# EasyEDA schematic Arduino.json

## Sheets
1 Arduino_Keypad 3X3: TITLE: Sheet_1; REV: 1.0; Date: 2023-11-30; Sheet: 1/1; Company: Your Company
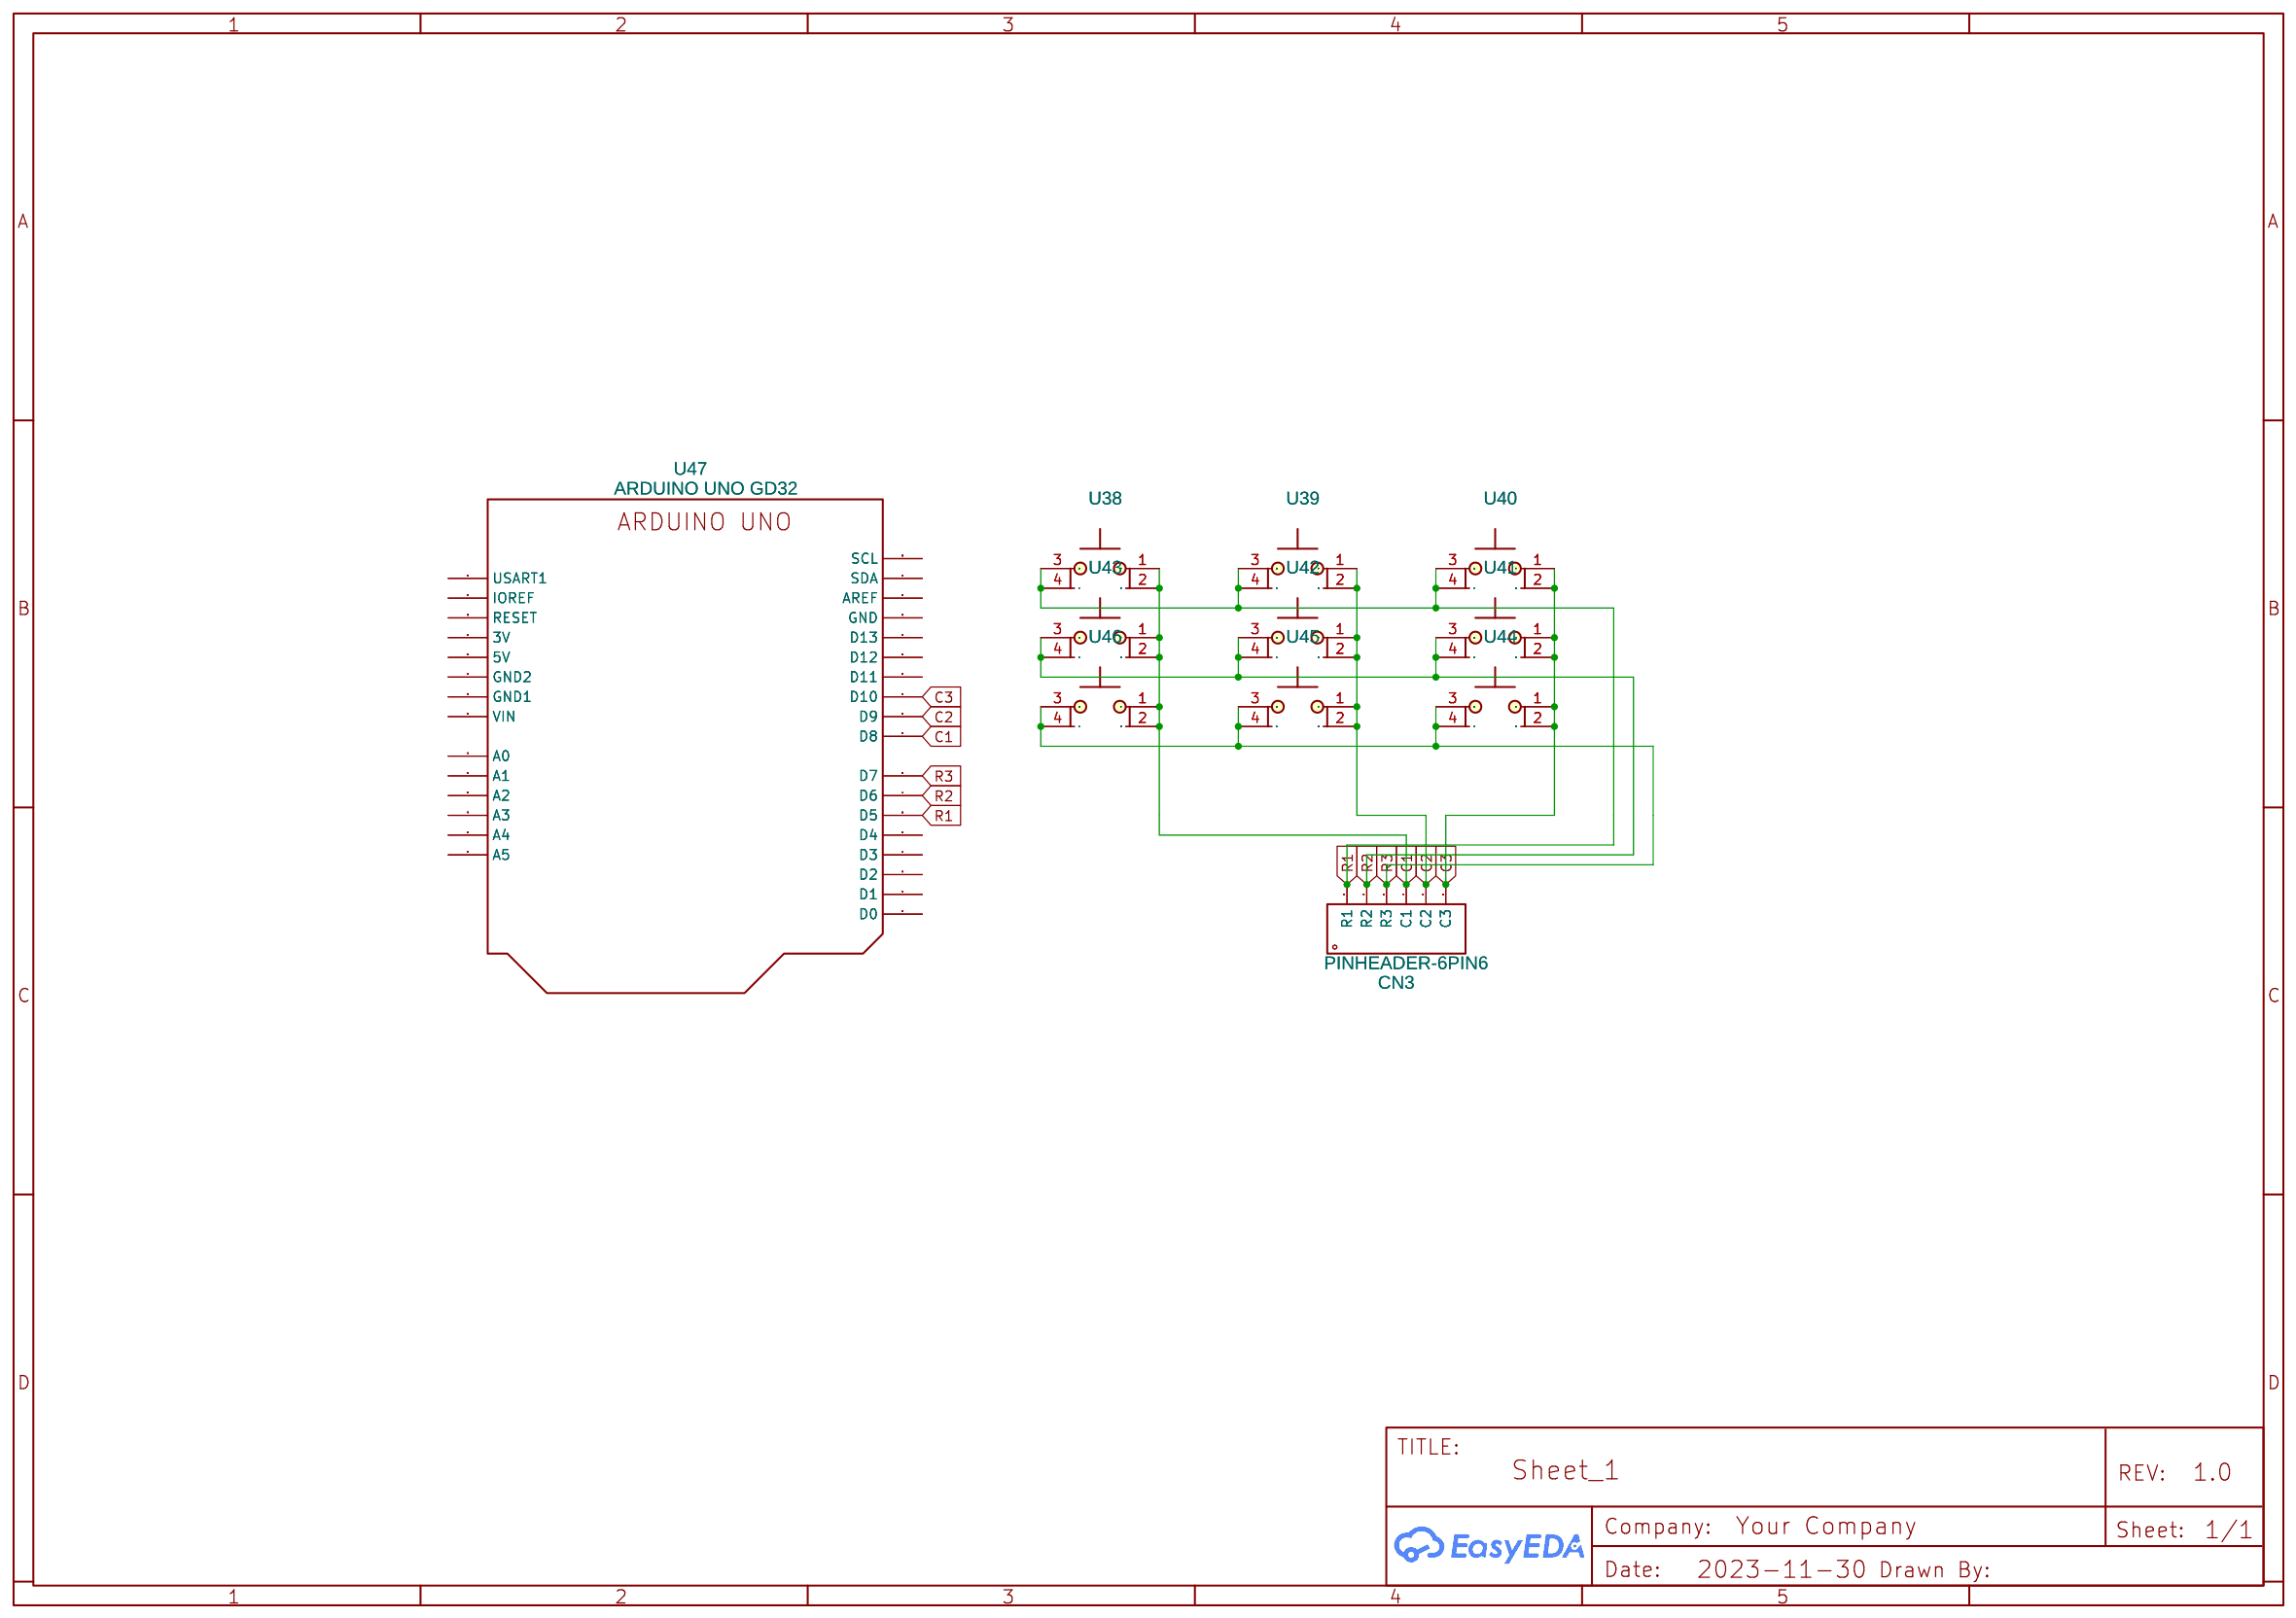
[diagram p0: Arduino_Keypad 3X3]
2 Arduino_LCD 16x2
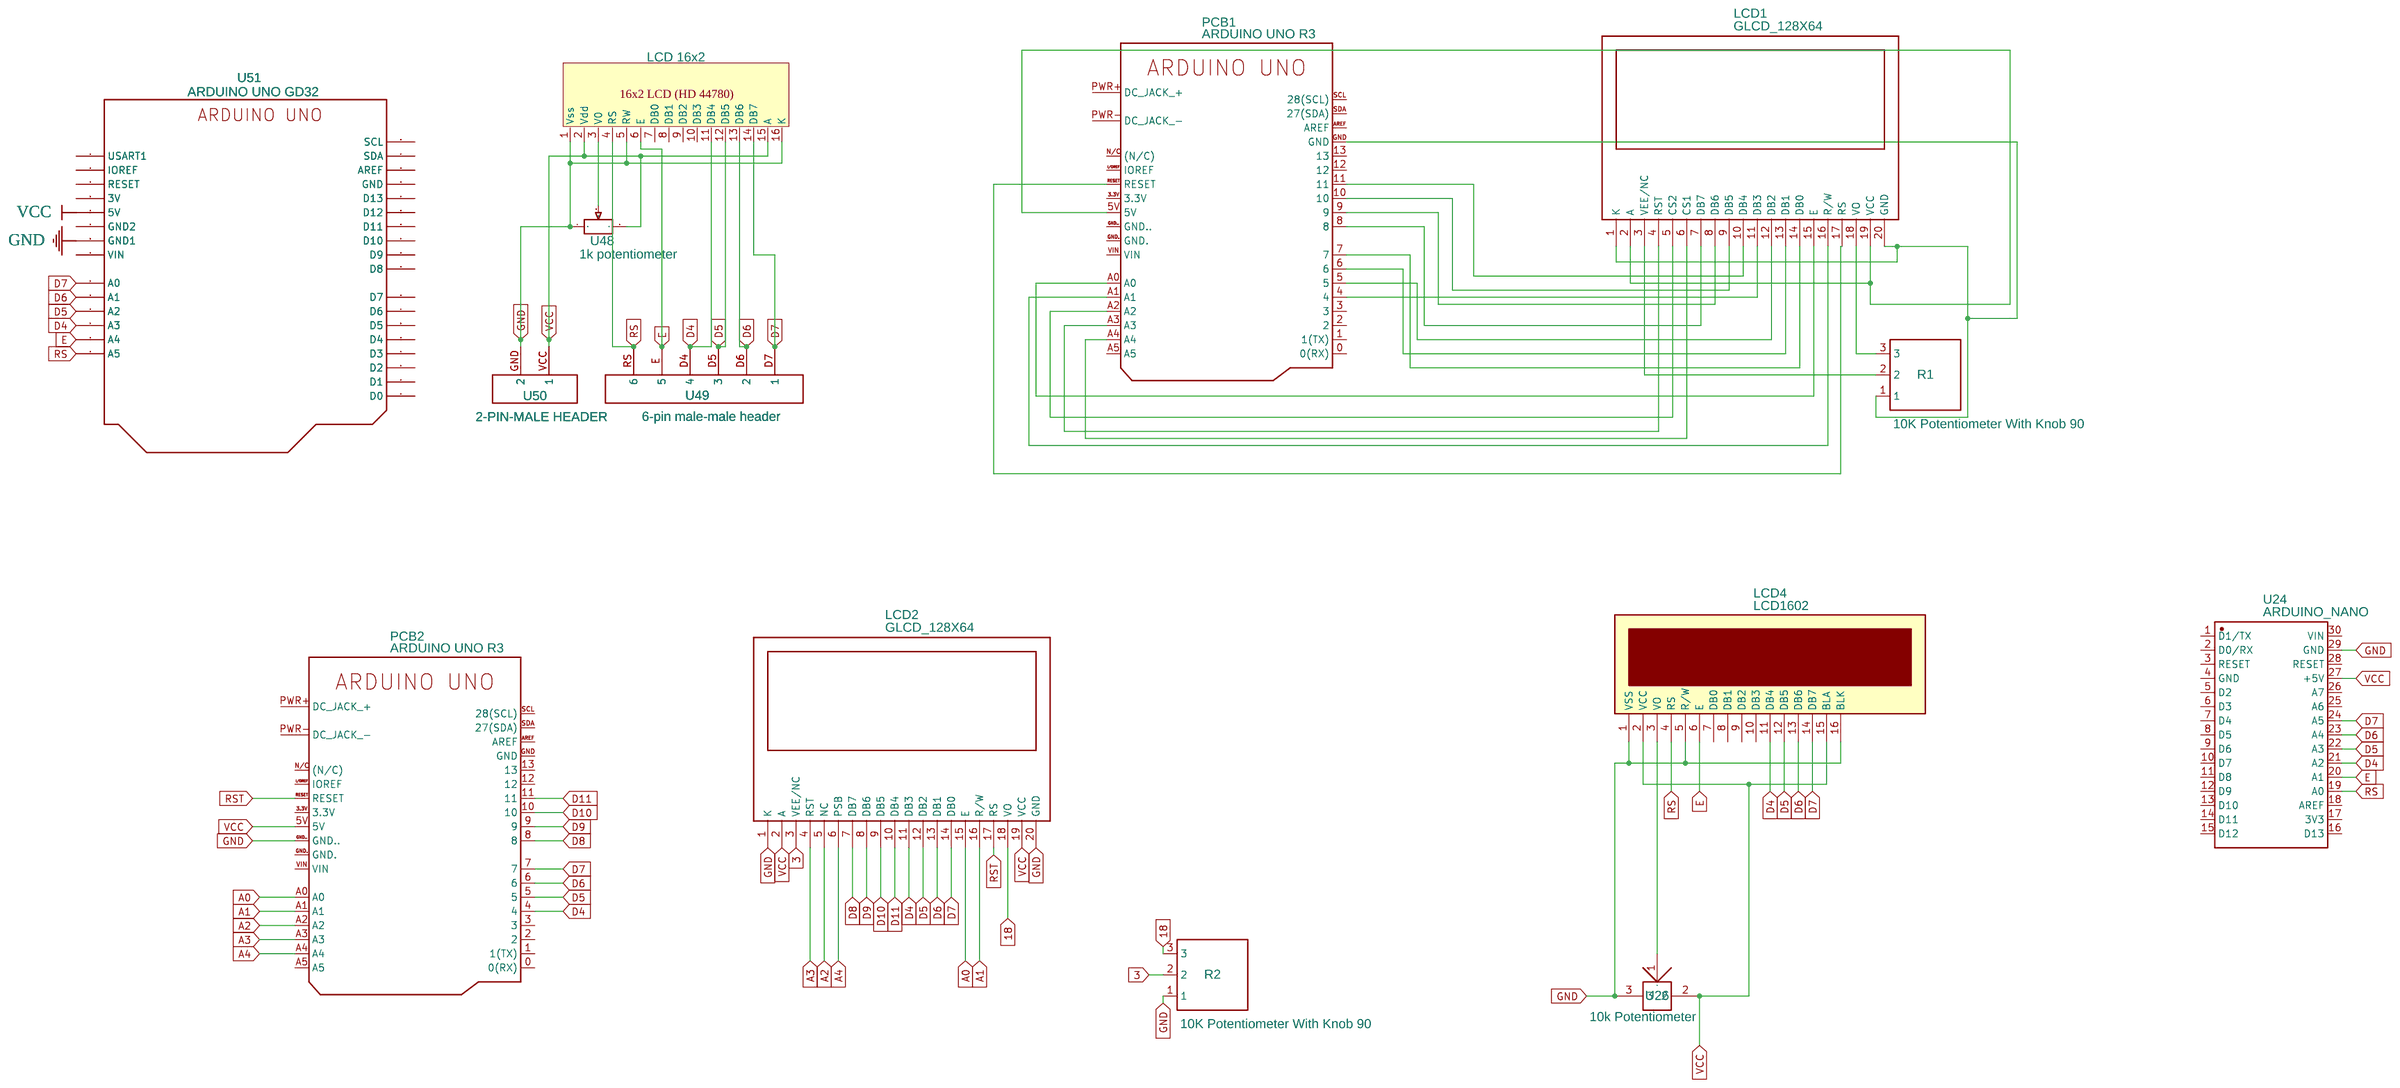
[diagram p1: Arduino_LCD 16x2]
3 Arduino_EM-18 Module
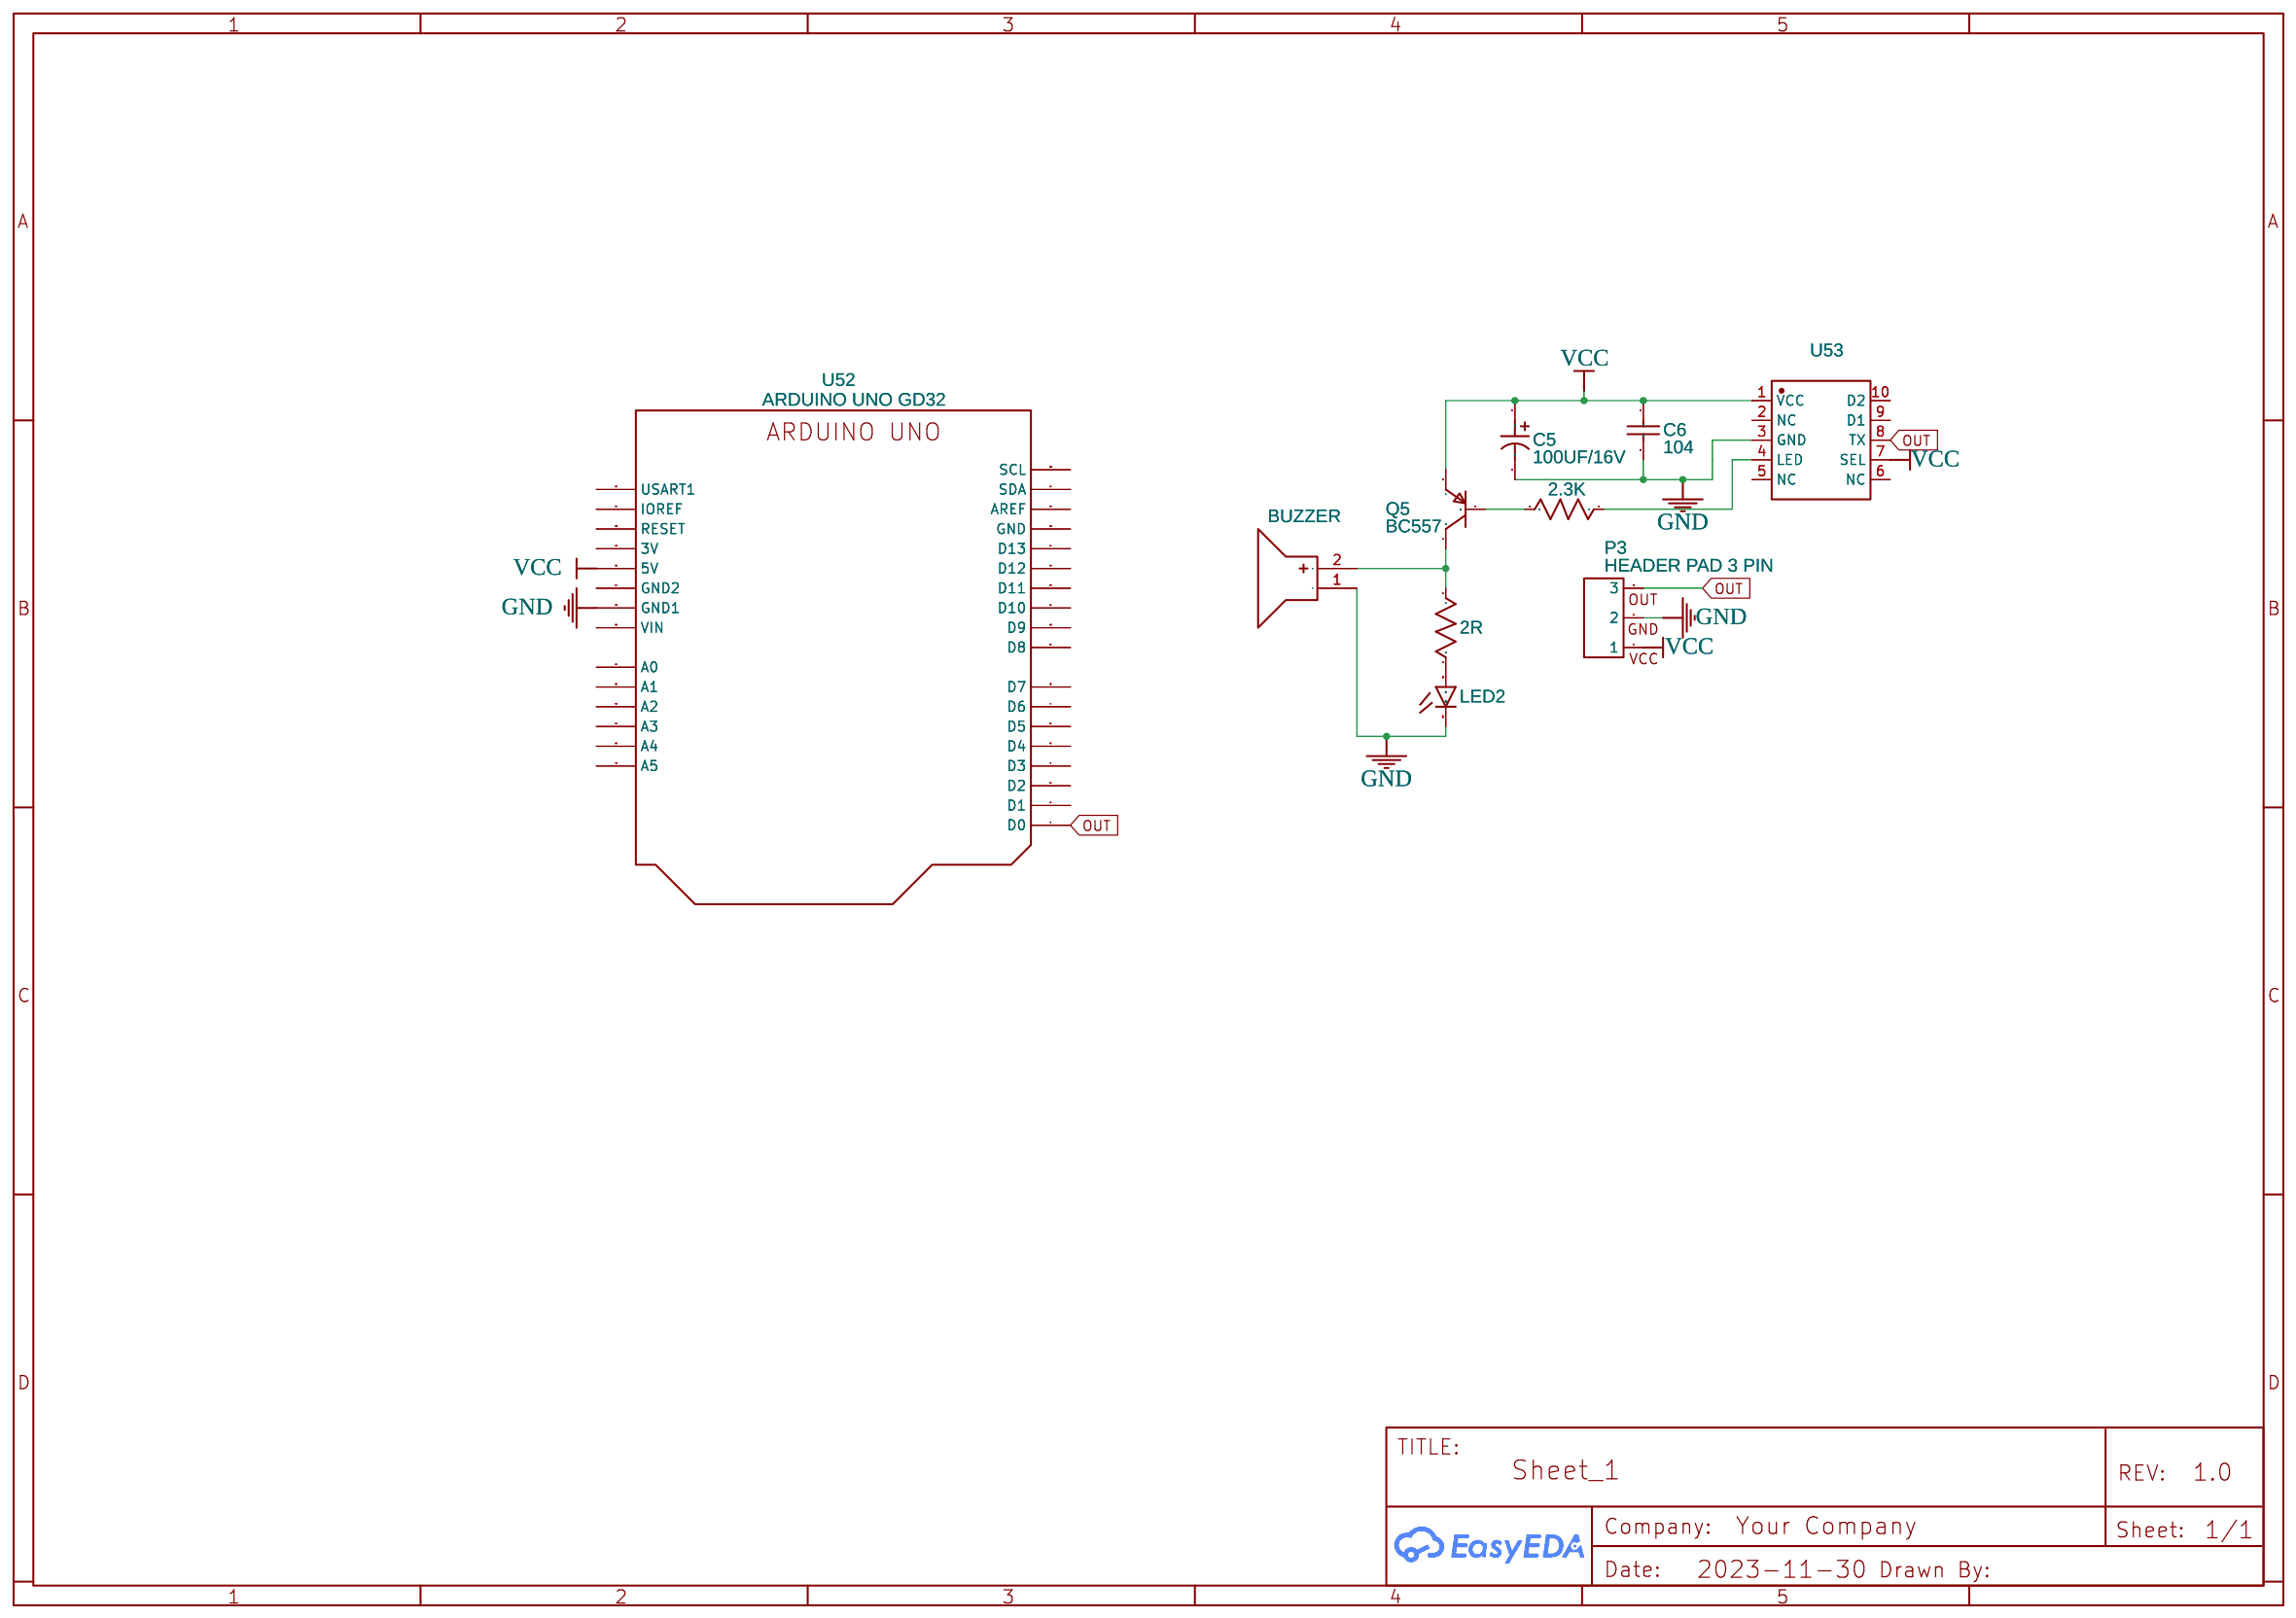
[diagram p2: Arduino_EM-18 Module]
4 Arduino_Relay Module
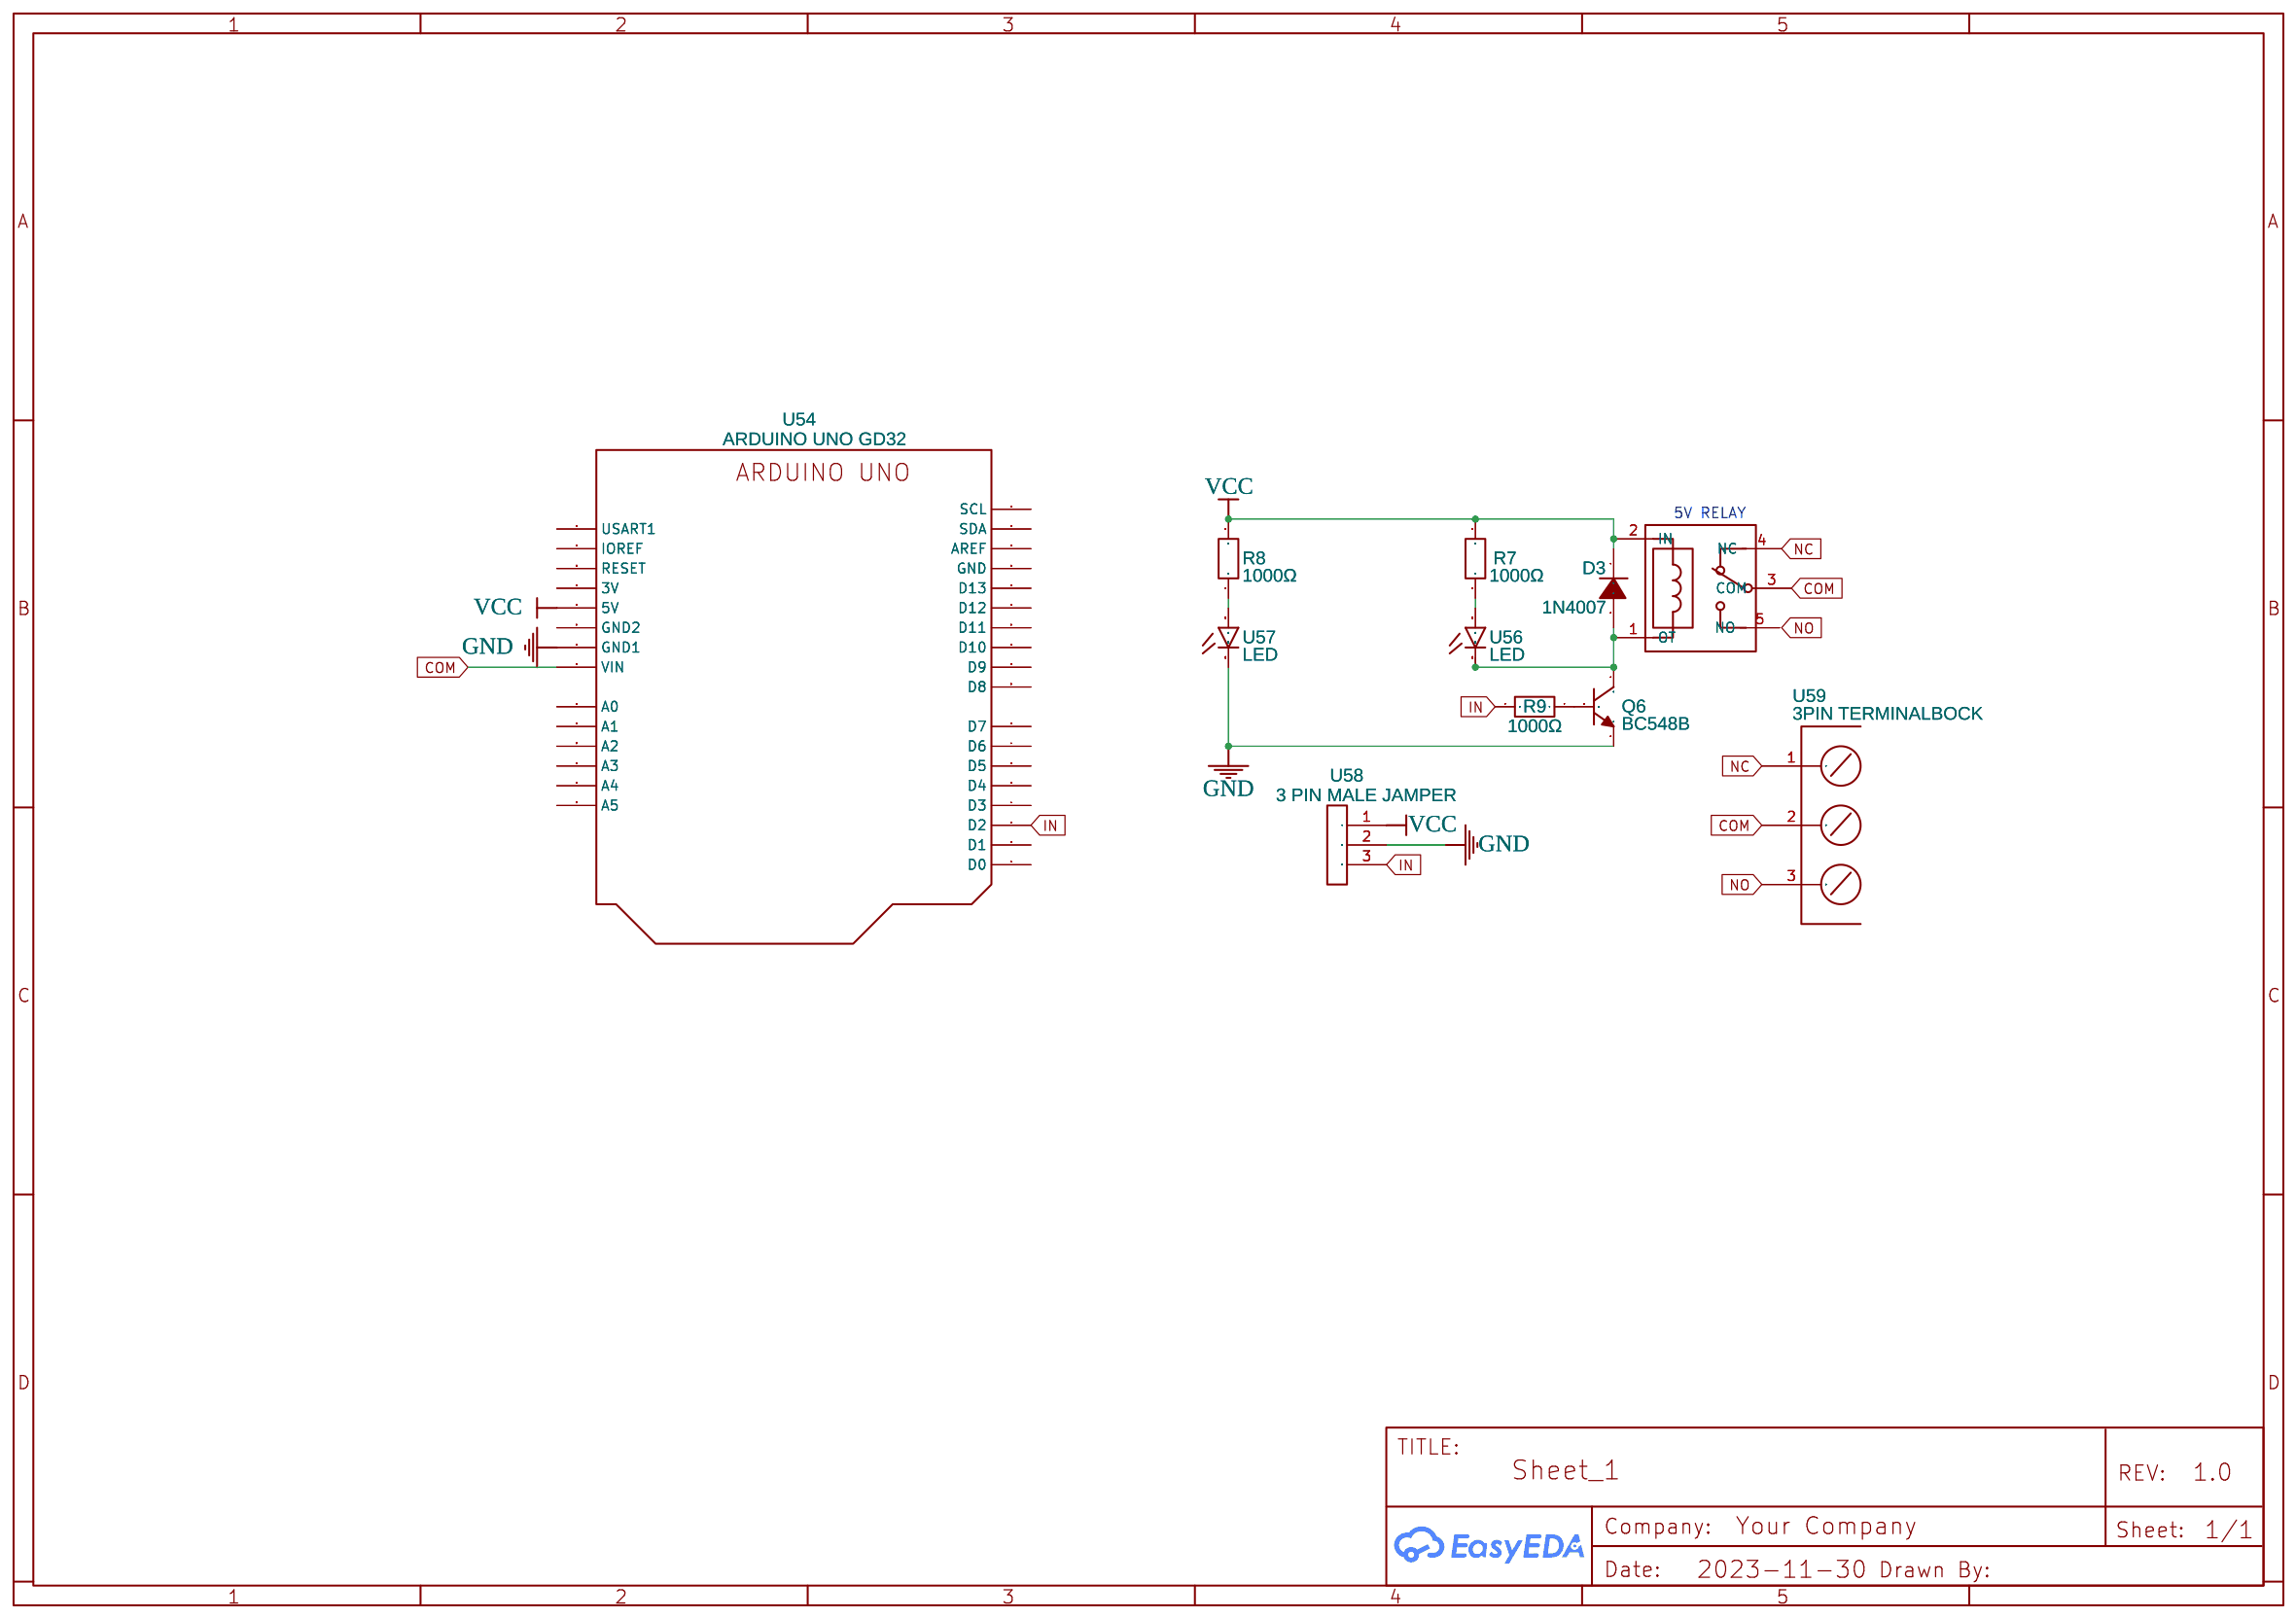
[diagram p3: Arduino_Relay Module]
5 DHT-11 & DHT-22: Date: 2024-01-26; Drawn By: robotic maker
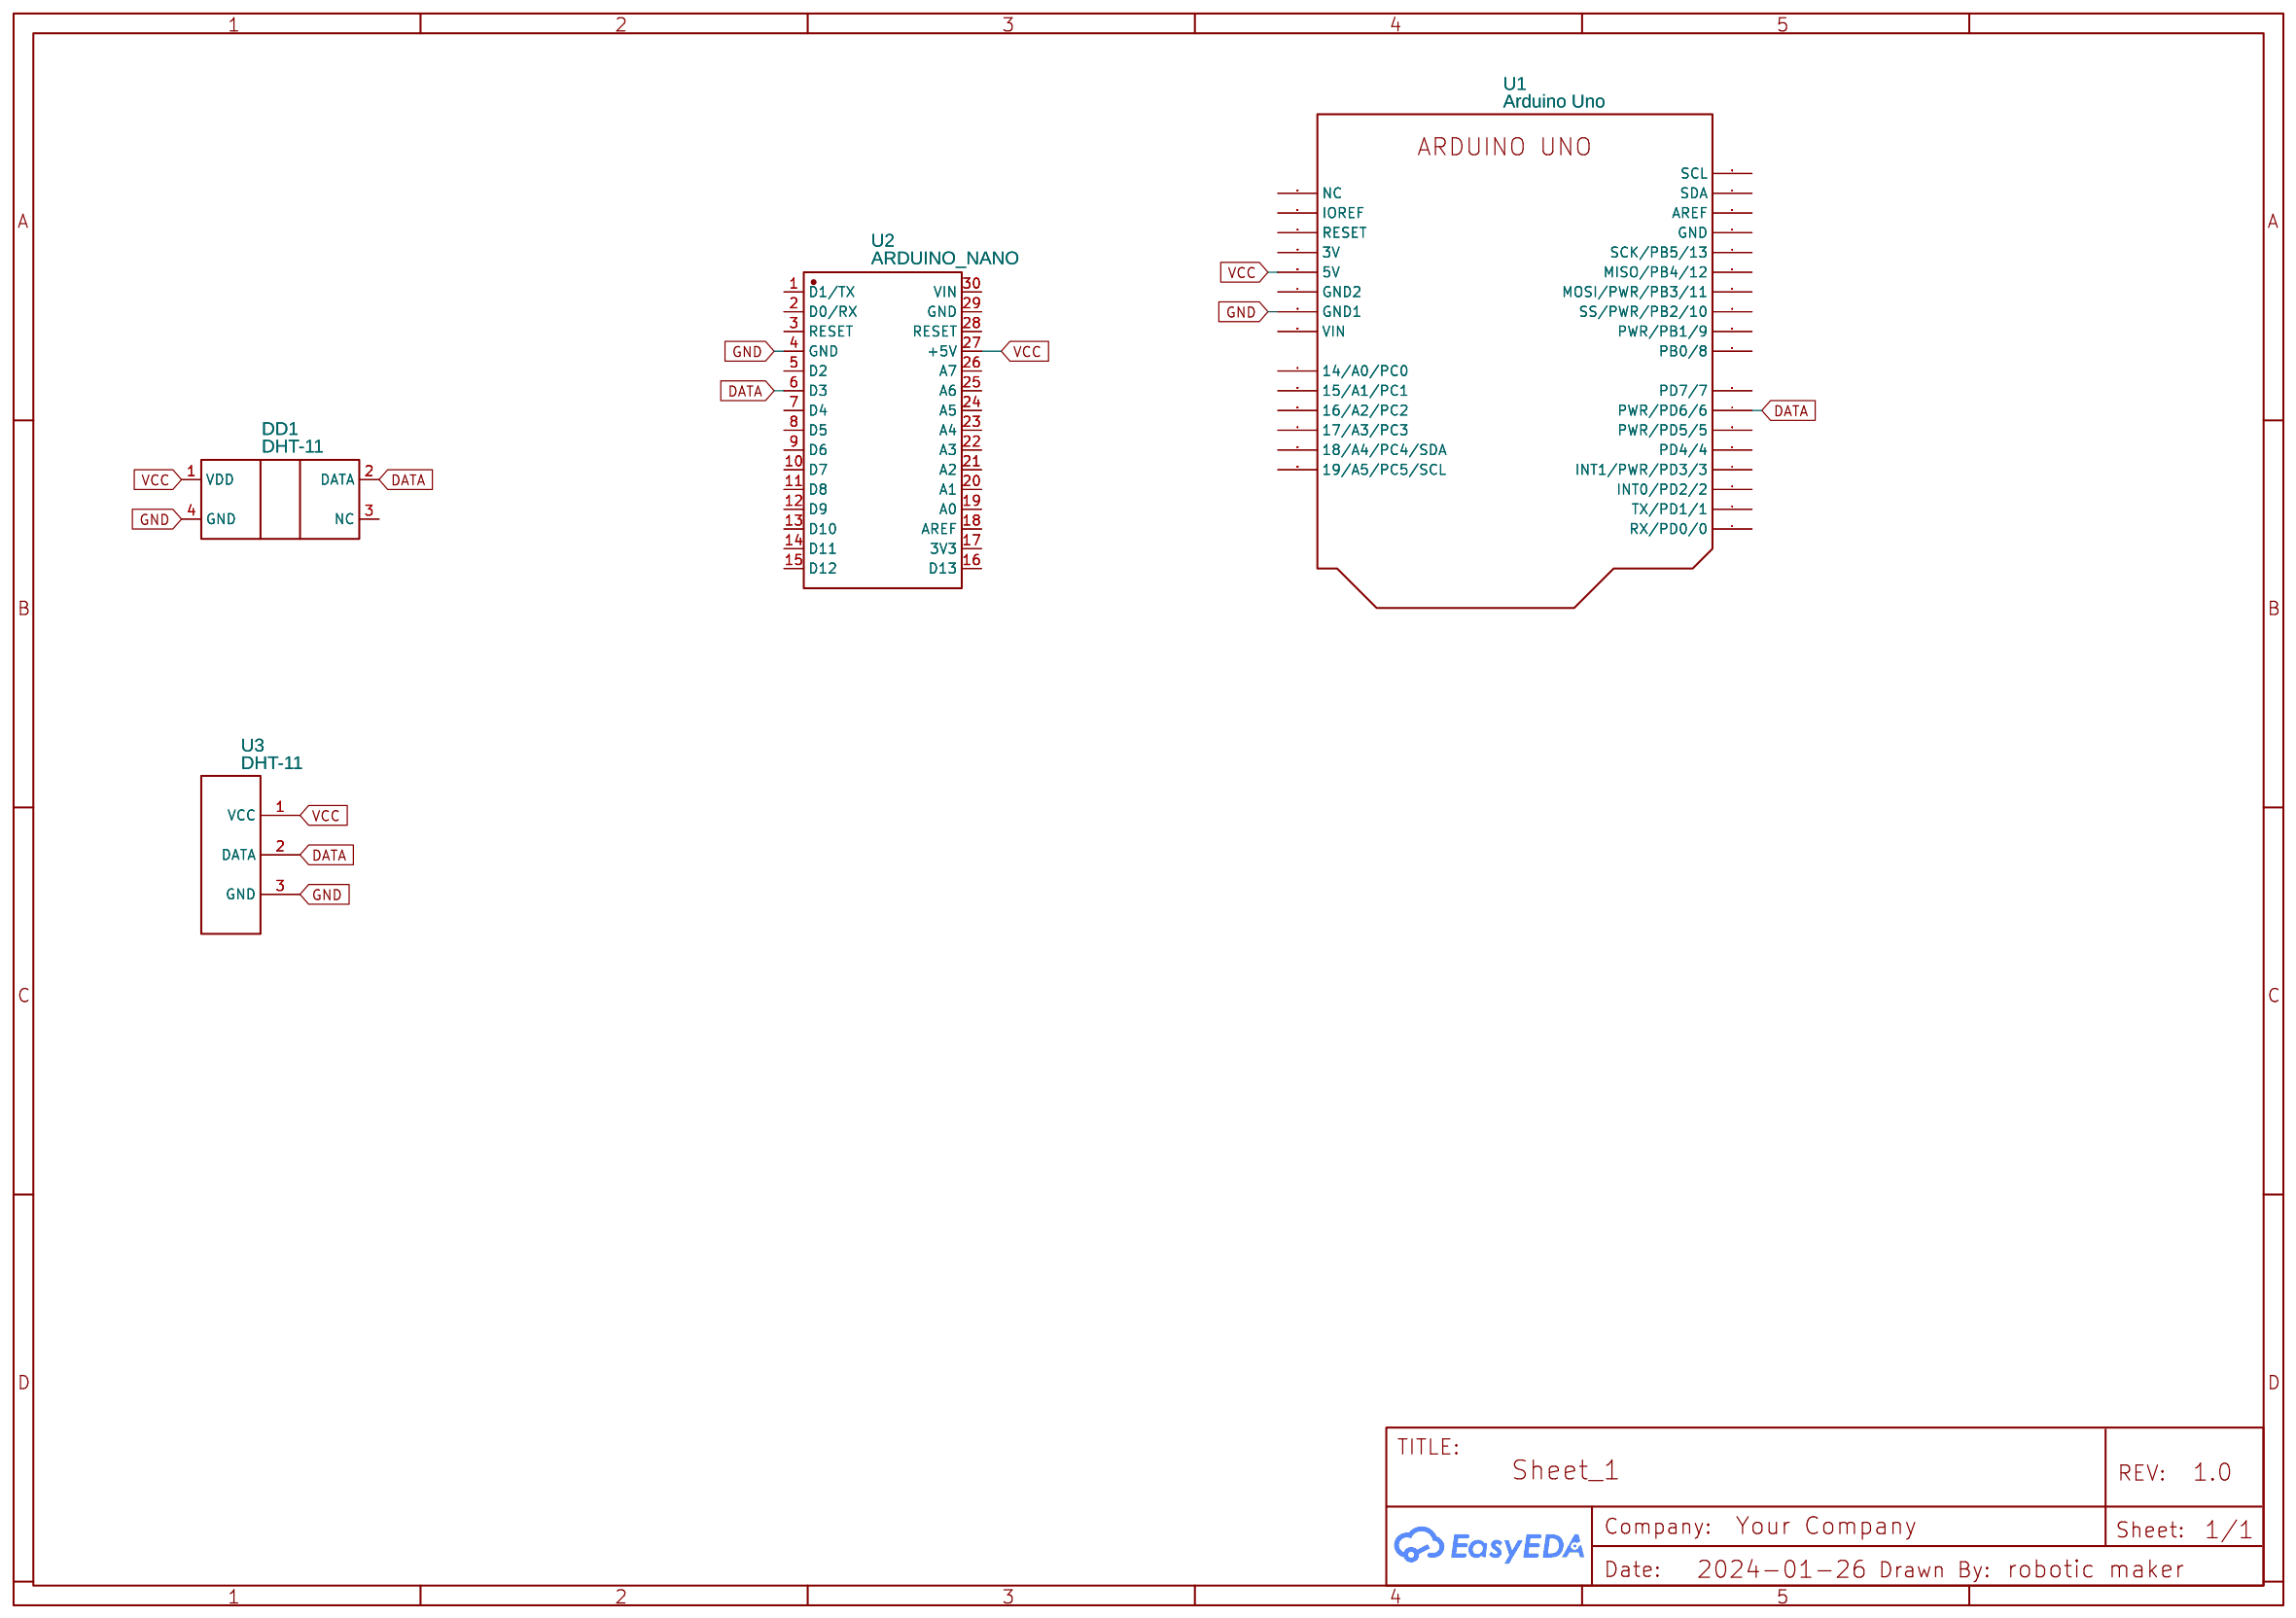
[diagram p4: DHT-11 & DHT-22]
6 Capacitive Soil Moisture Sensor: Date: 2024-01-26; Drawn By: robotic maker
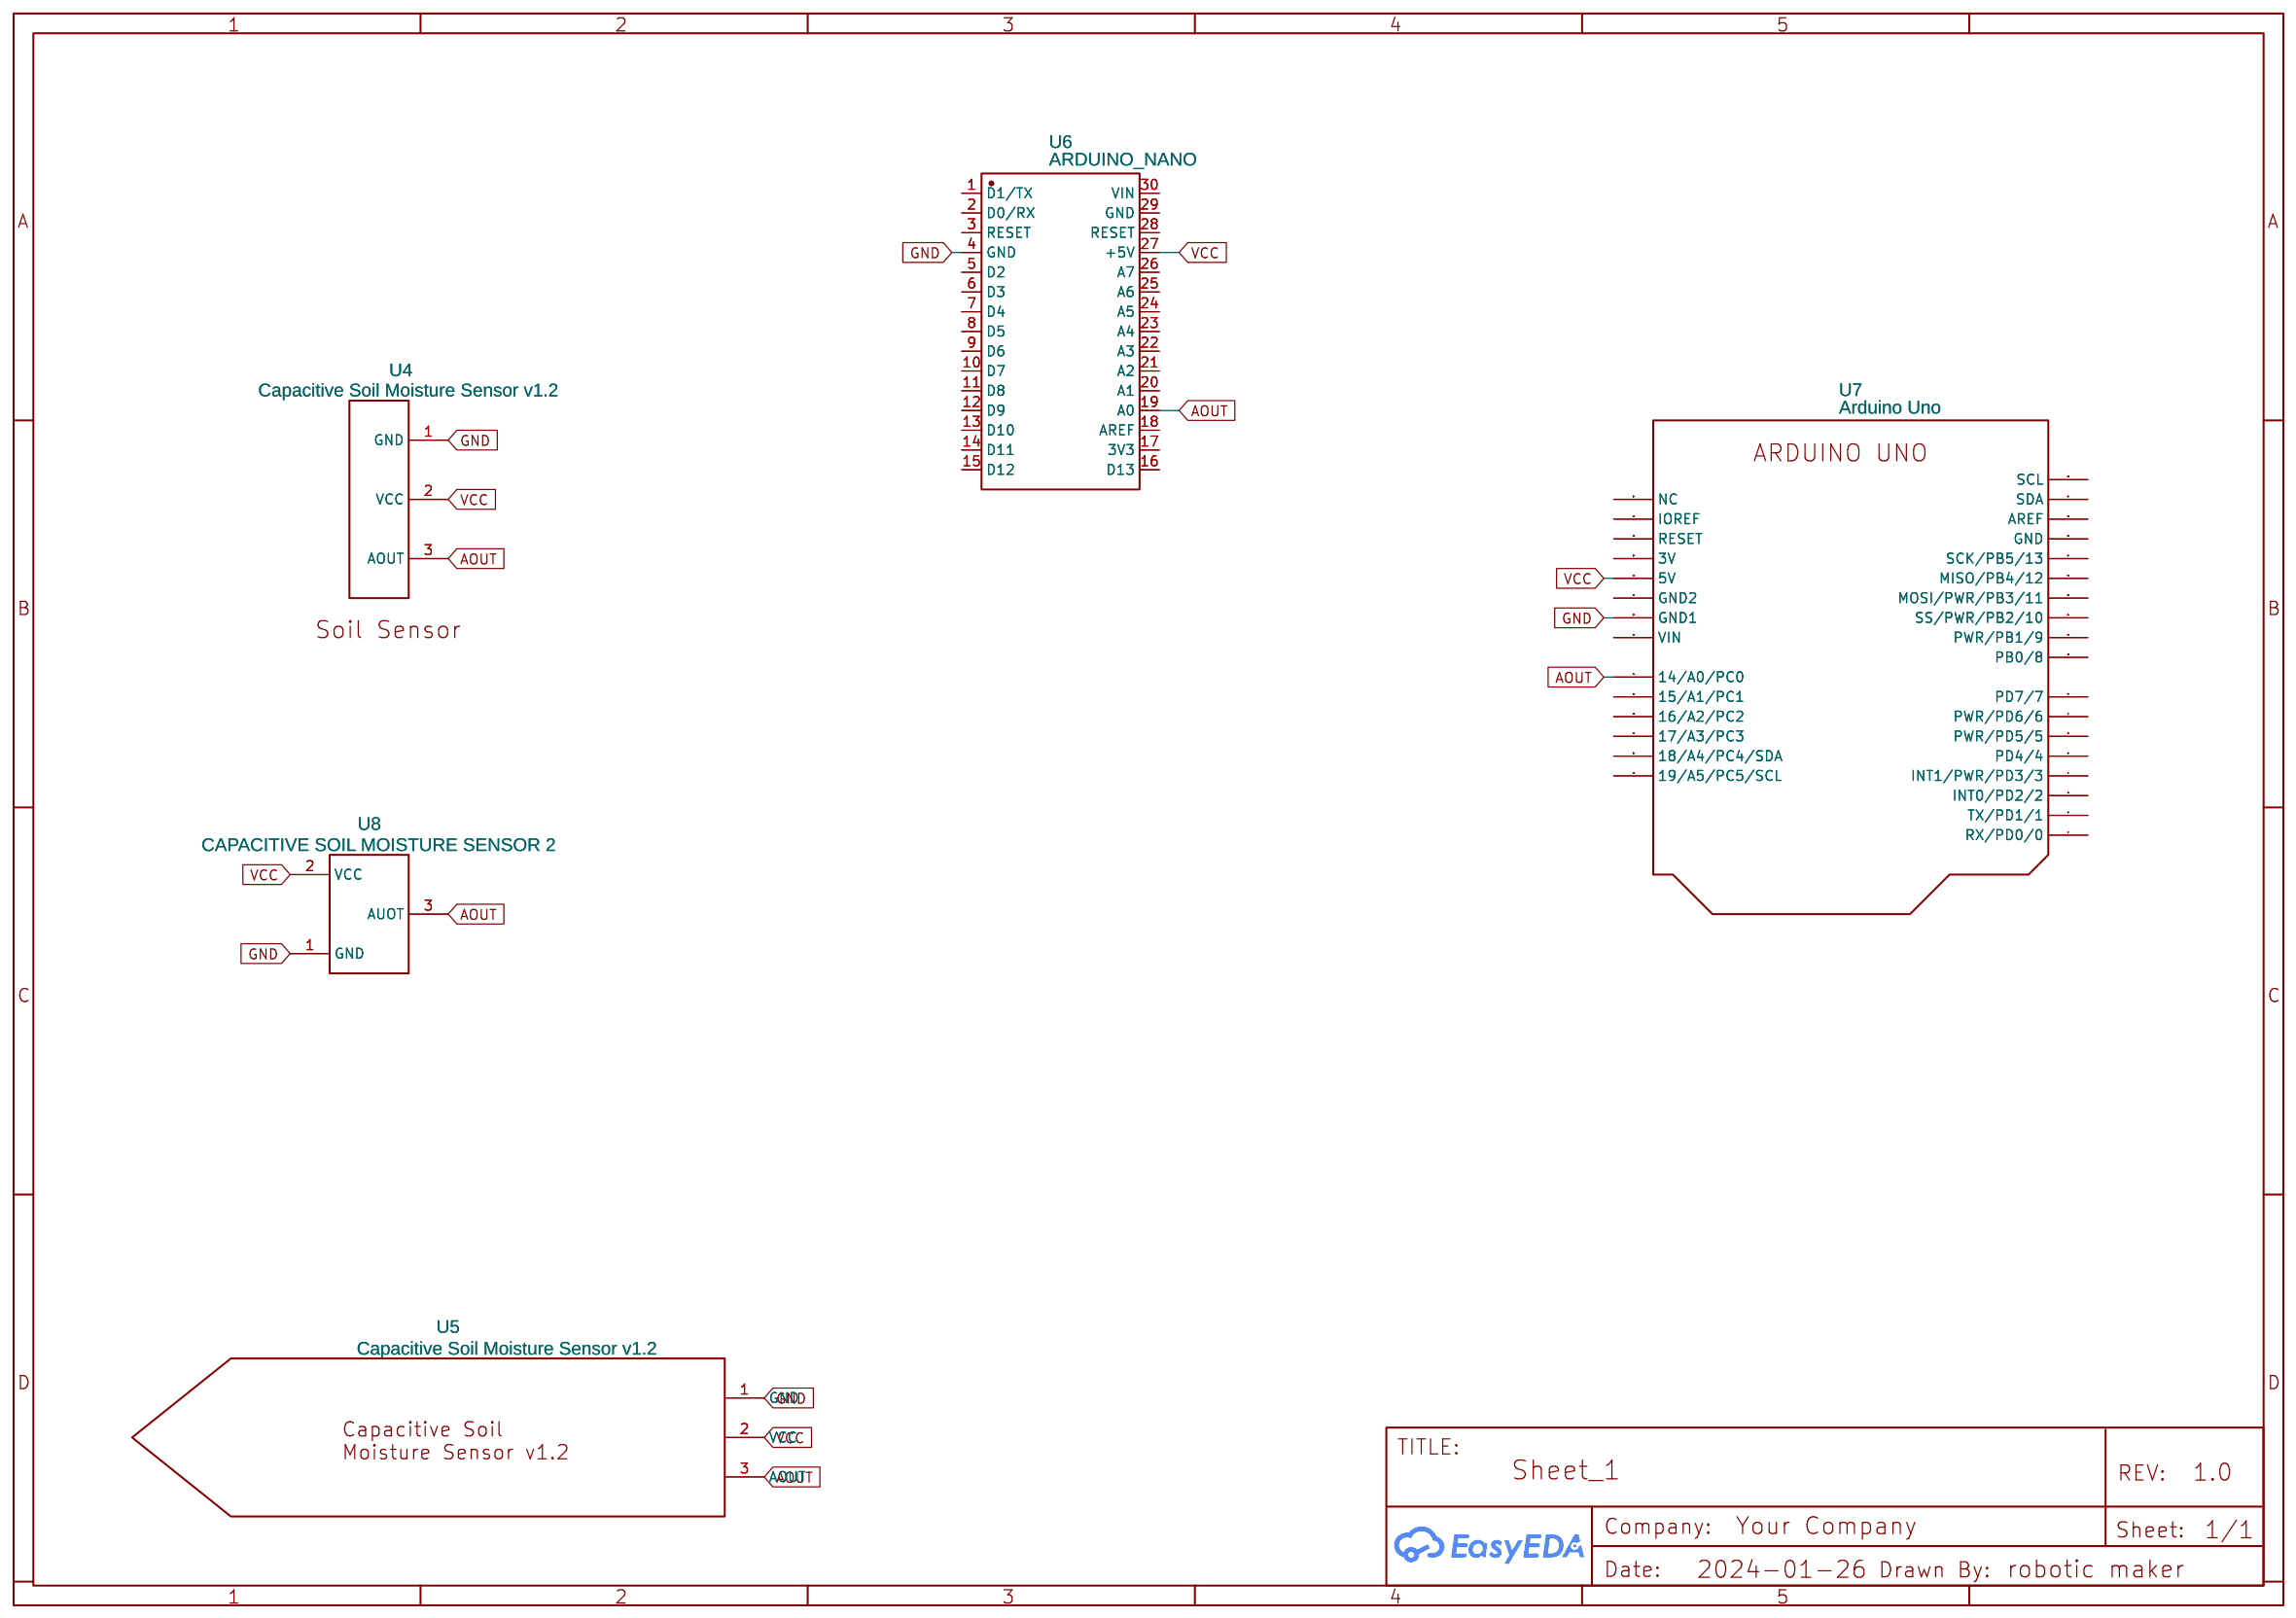
[diagram p5: Capacitive Soil Moisture Sensor]
7 Soil Moisture Sensor: Date: 2024-01-26; Drawn By: robotic maker
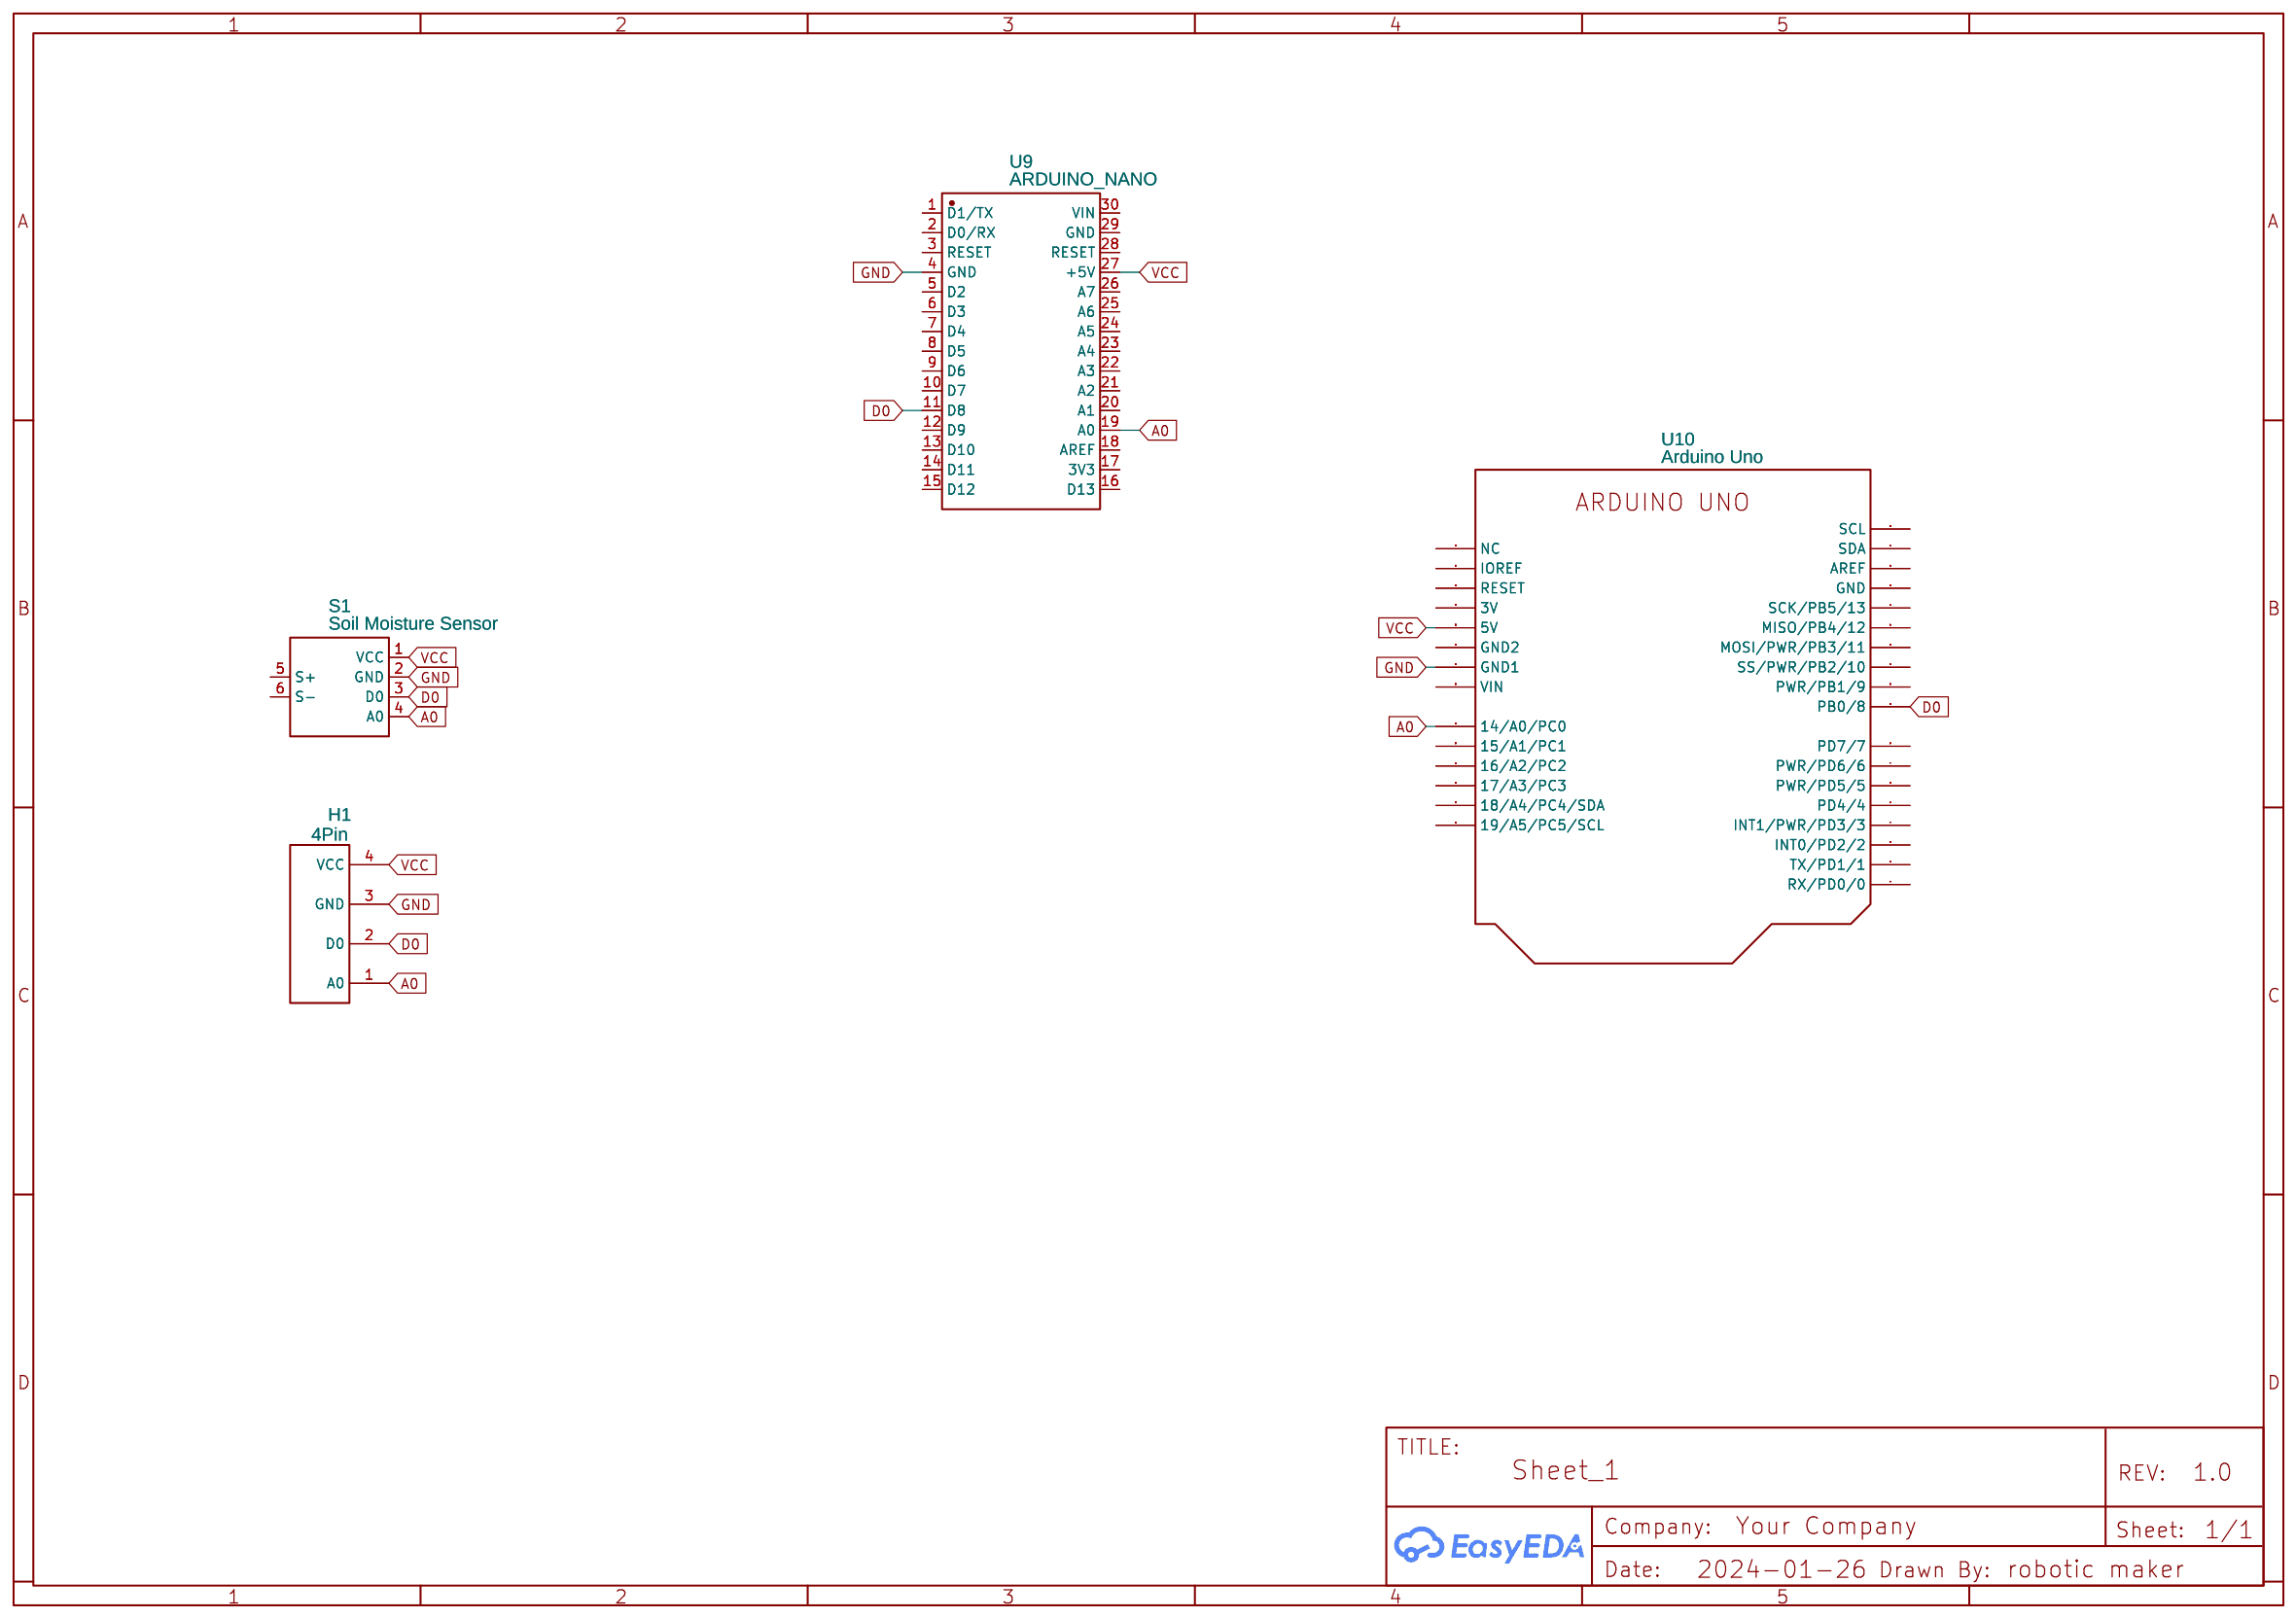
[diagram p6: Soil Moisture Sensor]
8 BH1750
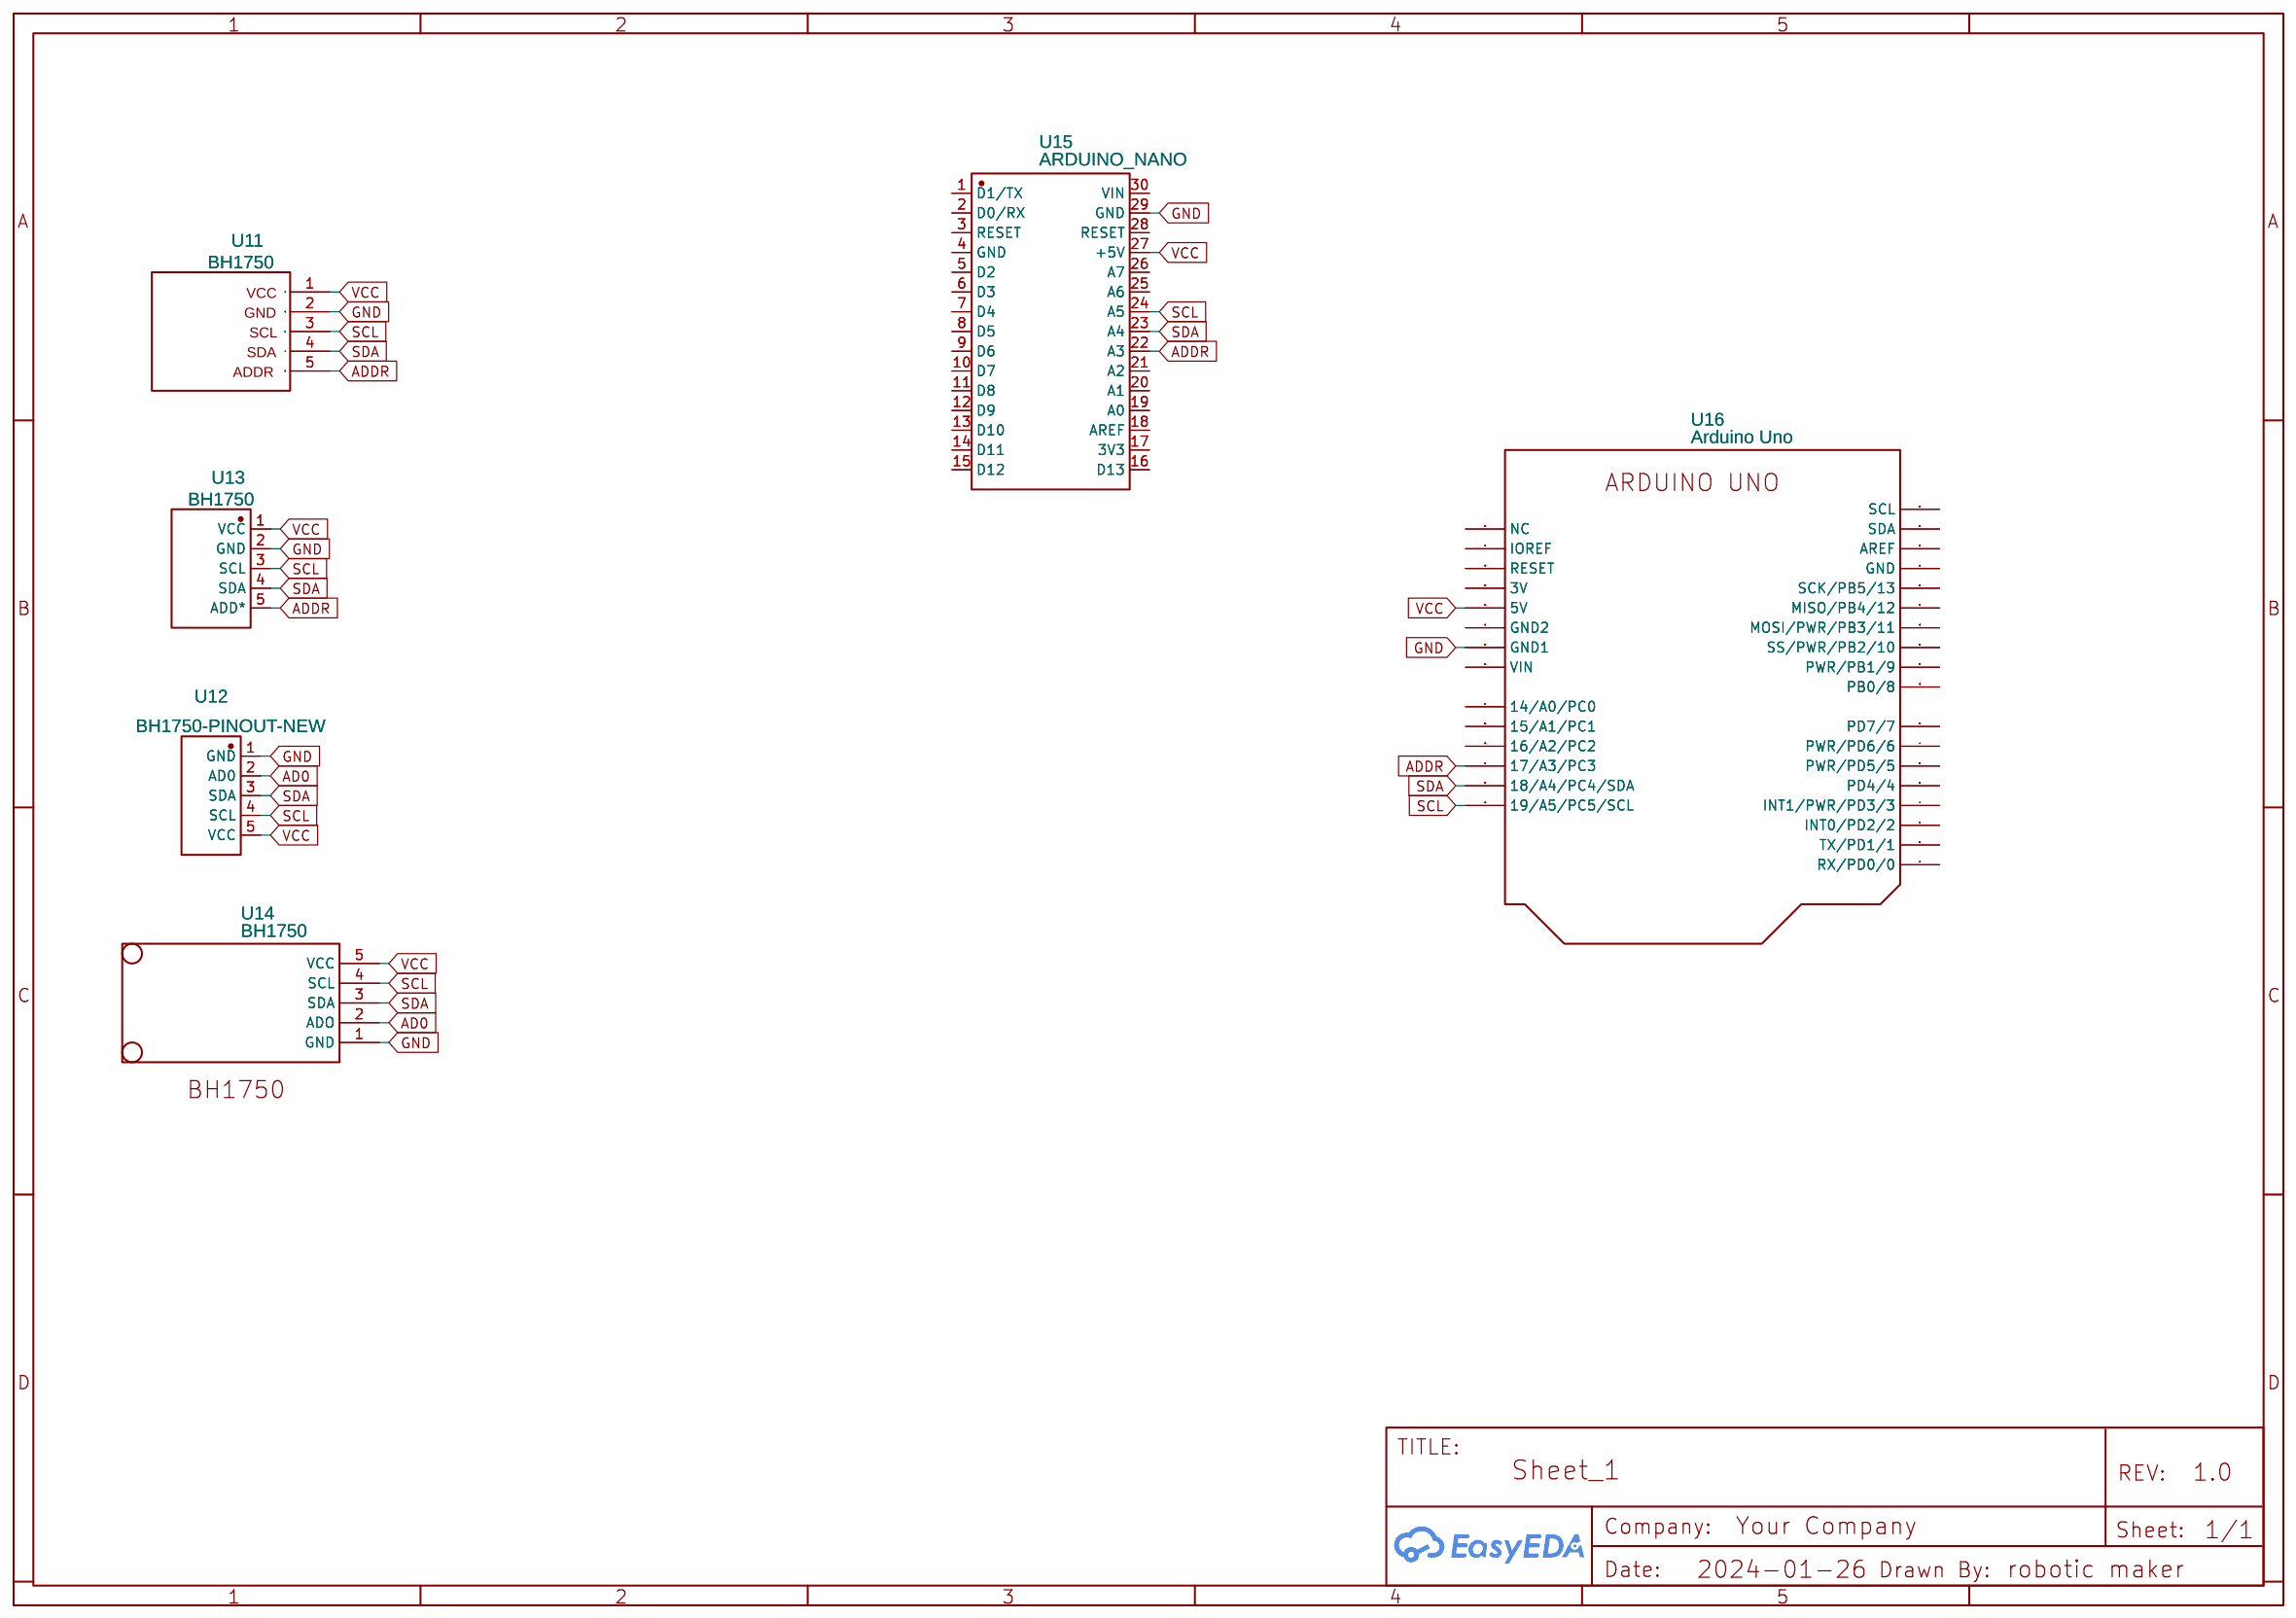
[diagram p7: BH1750]
9 Relay copy: Date: 2024-01-26; Drawn By: robotic maker
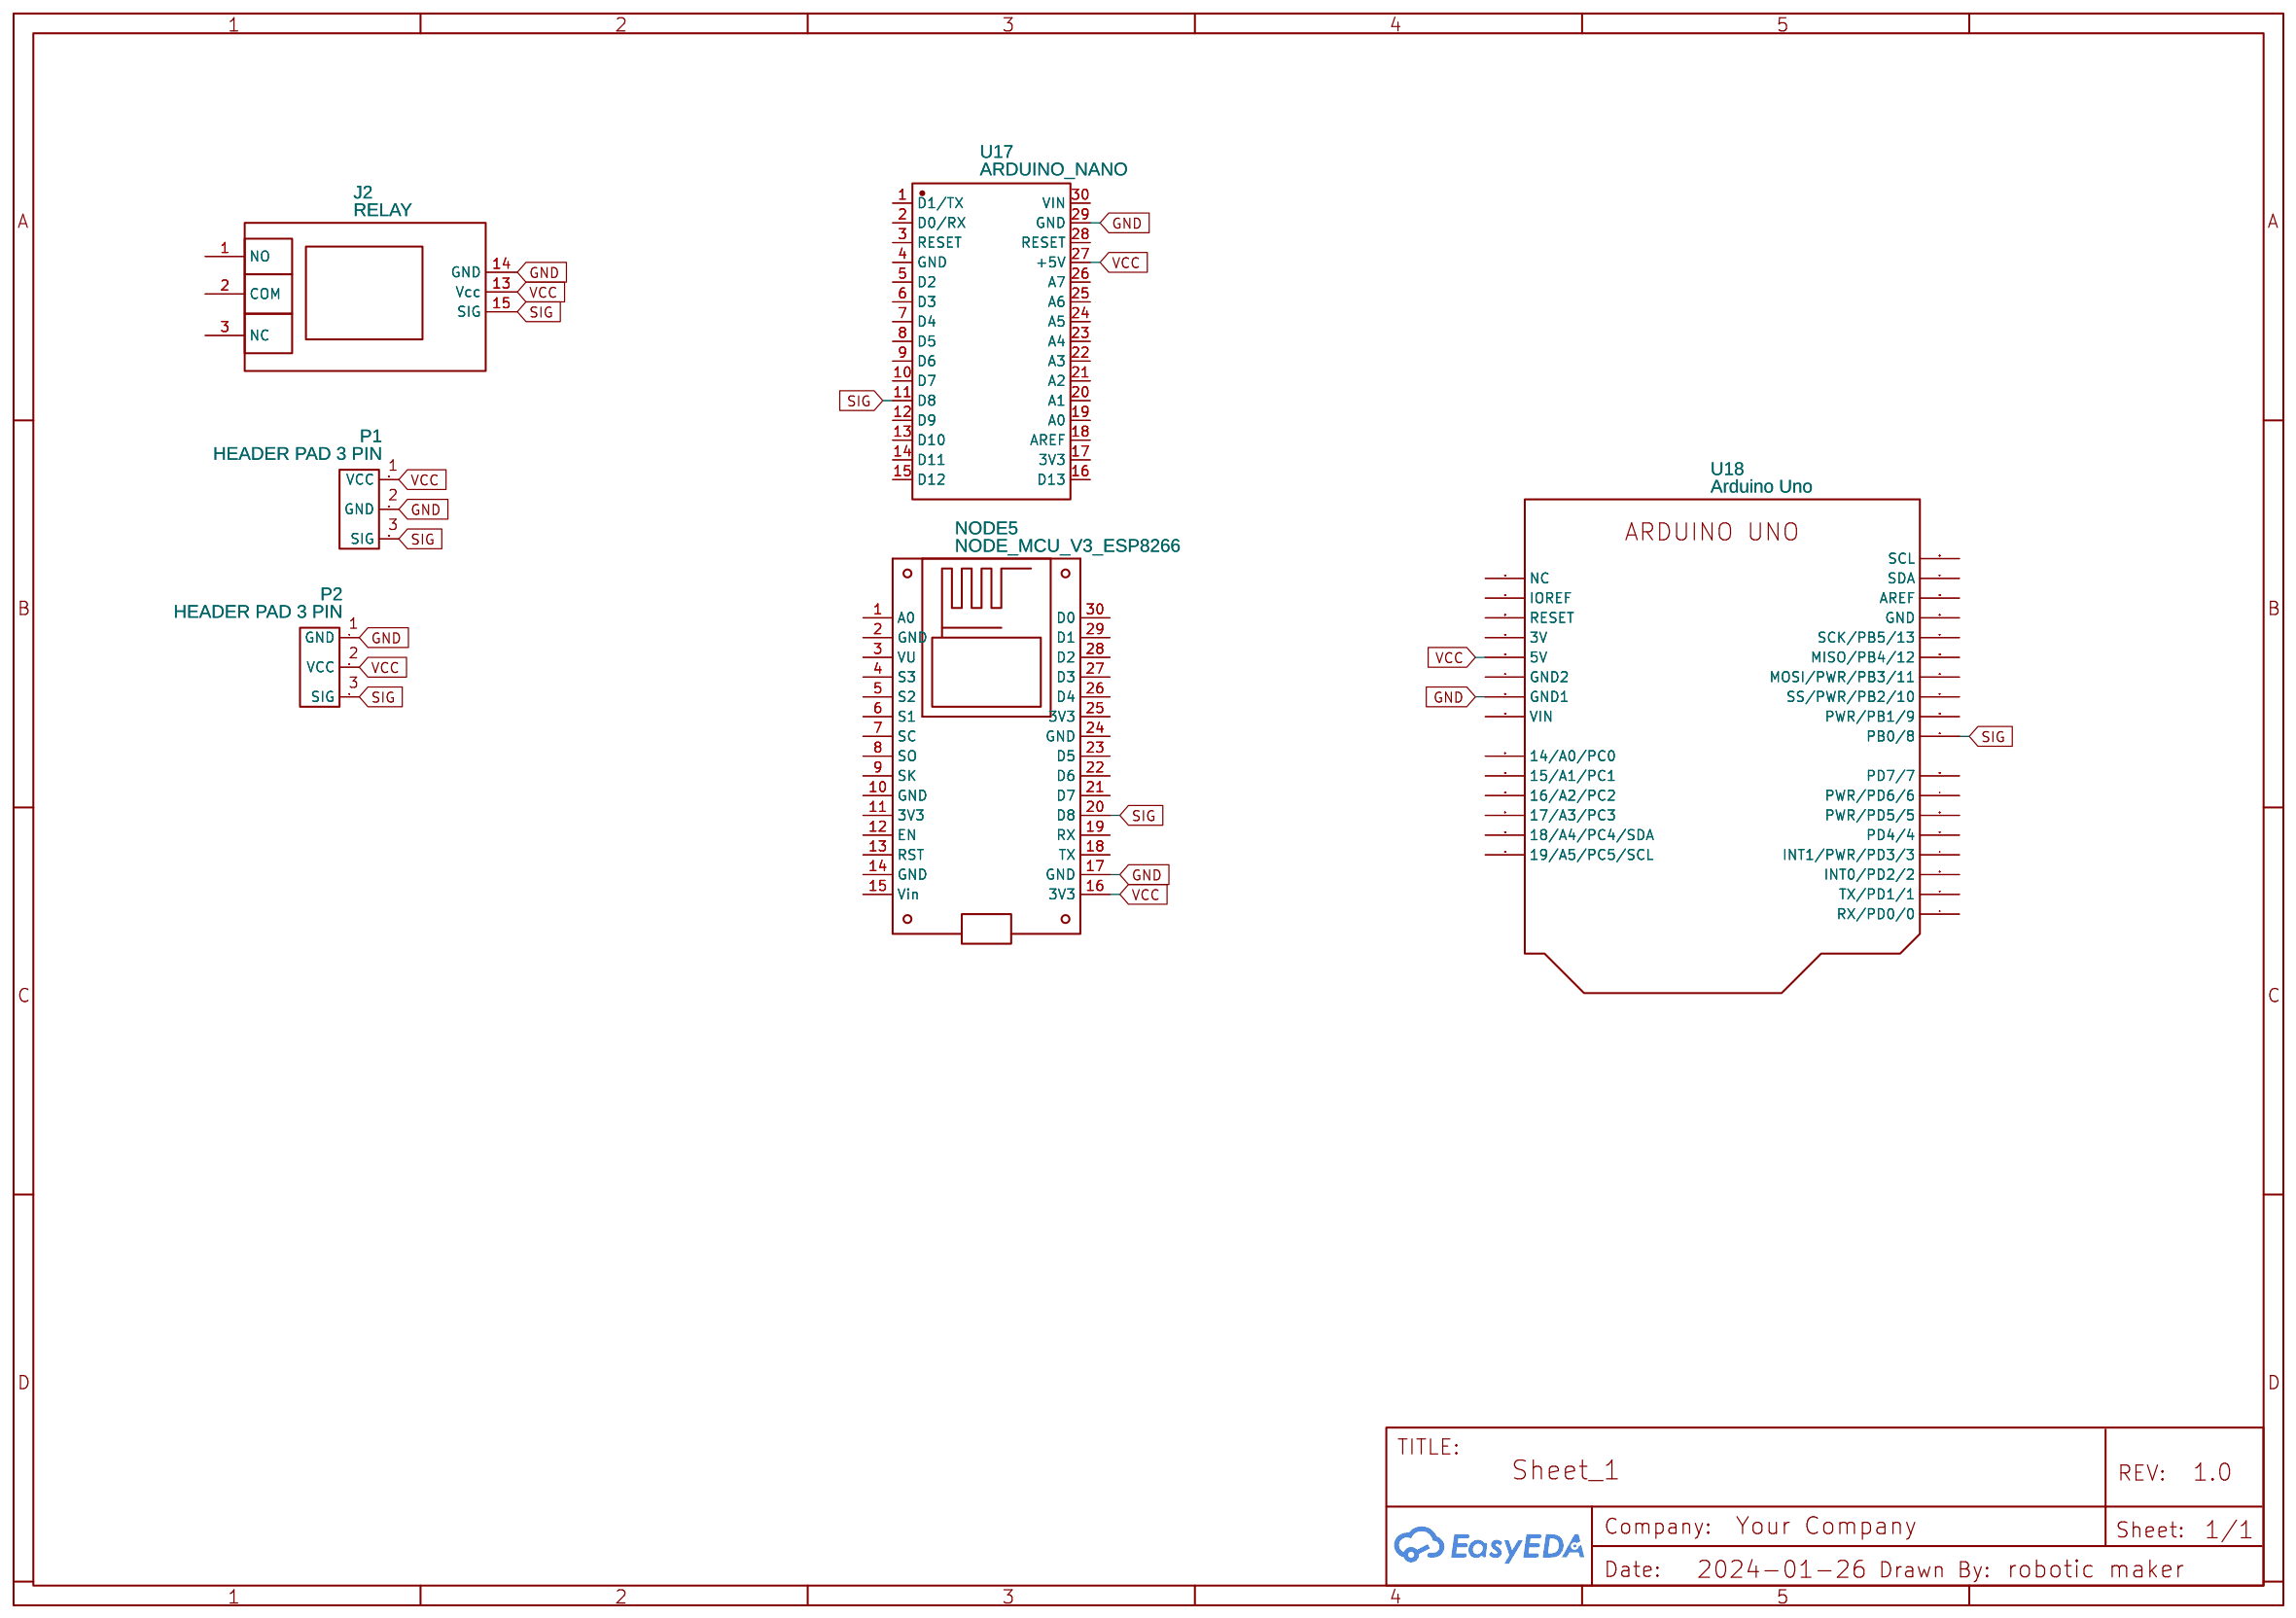
[diagram p8: Relay copy]
10 0.91 INCH OLED Display: Date: 2024-01-26; Drawn By: robotic maker
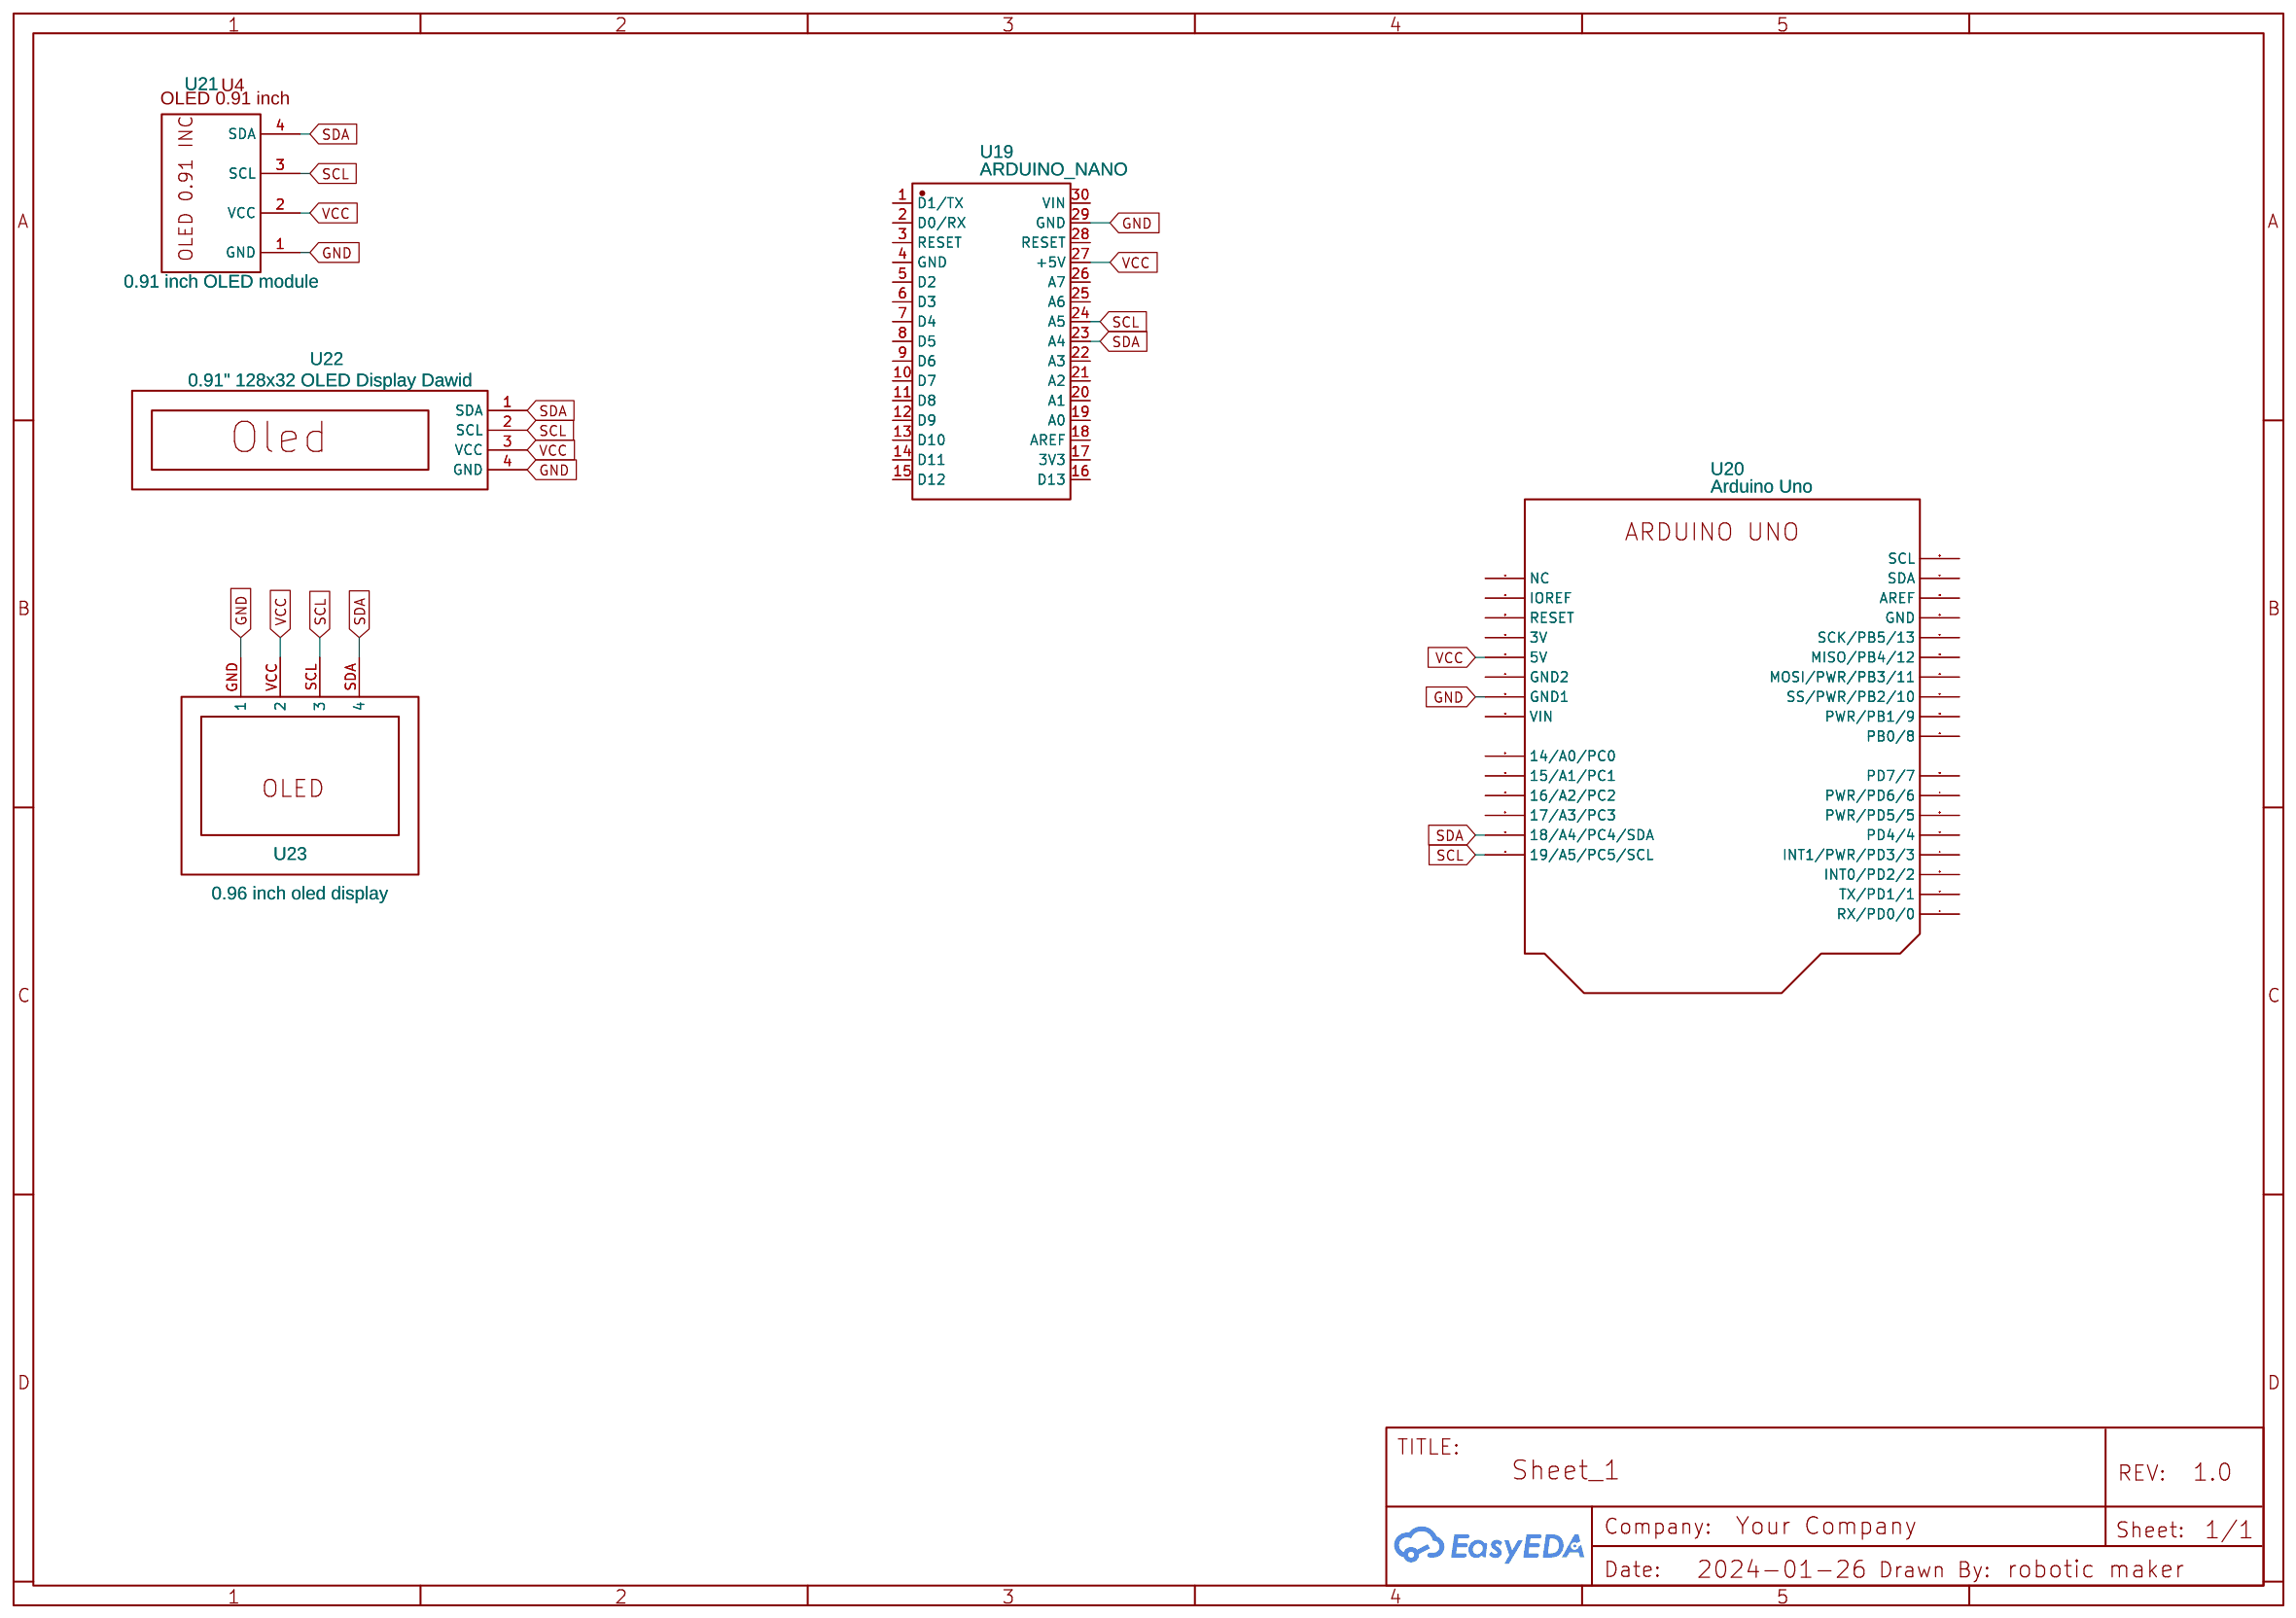
[diagram p9: 0.91 INCH OLED Display]
11 16X2 LCD Display I2C: Date: 2024-01-26; Drawn By: robotic maker
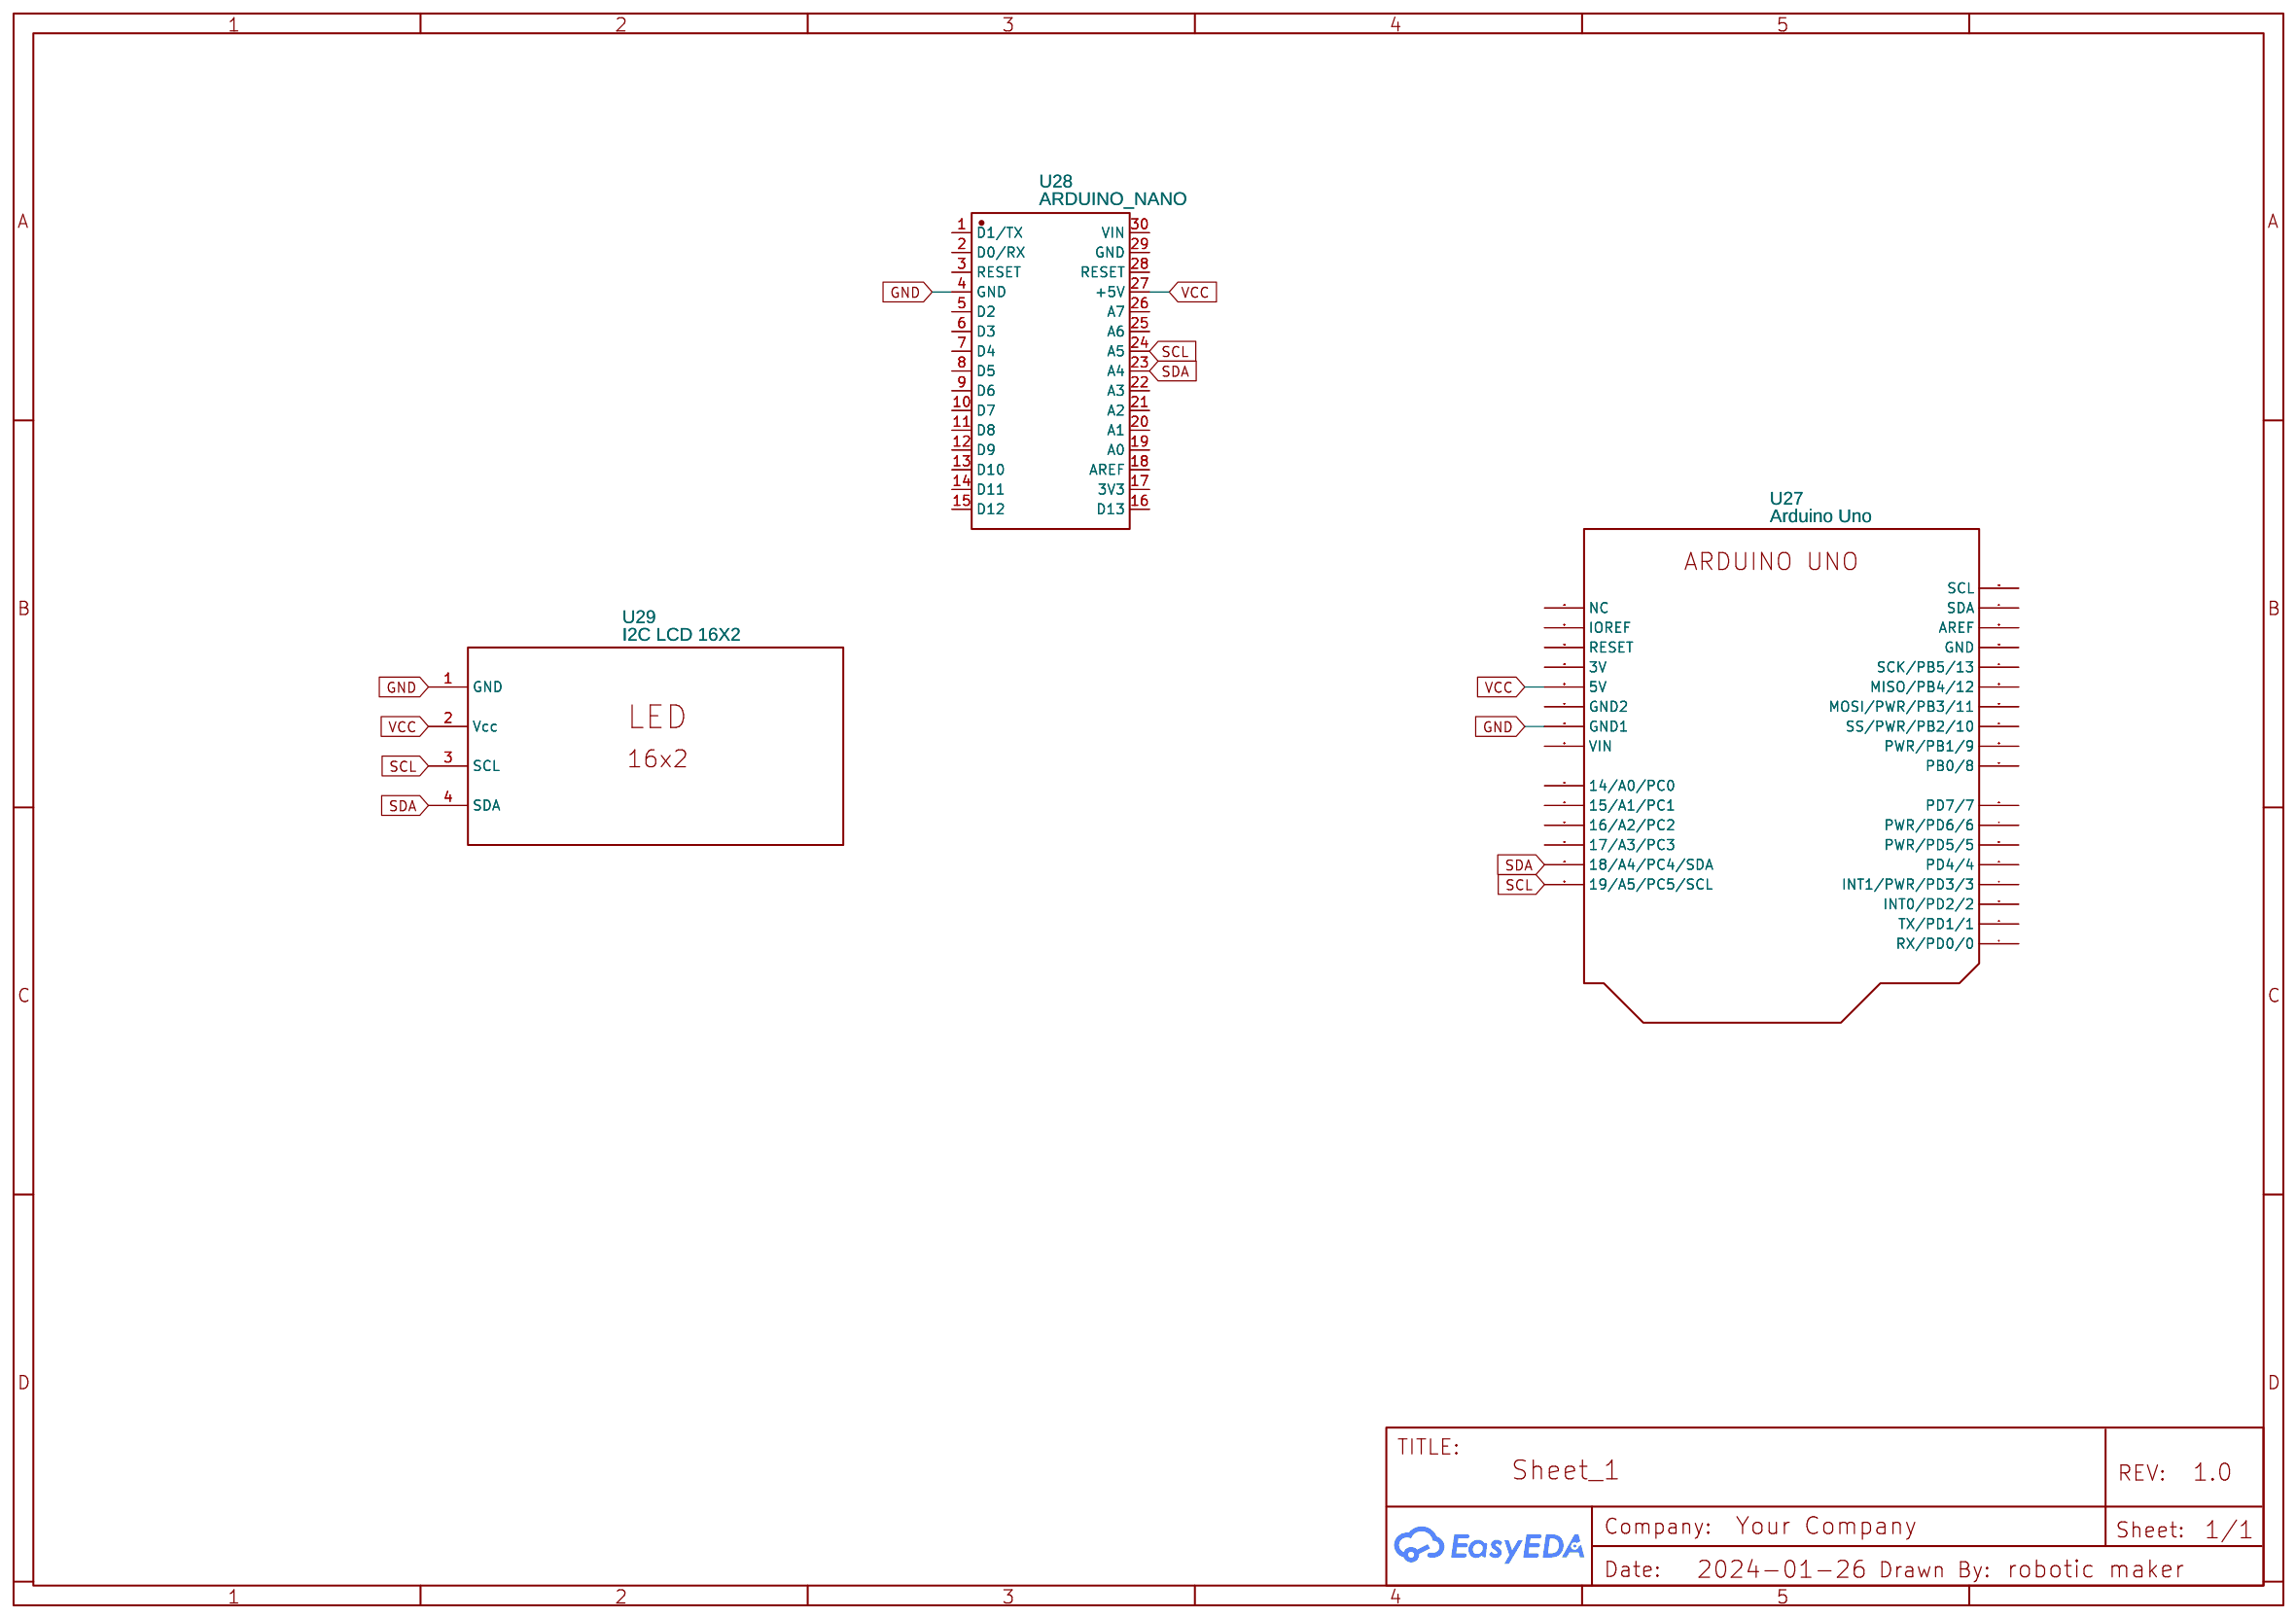
[diagram p10: 16X2 LCD Display I2C]

## Parts
sheet 0.91 INCH OLED Display
U19  ARDUINO_NANO  [COMM-TH_ARDUINO_NANO]
U20  Arduino Uno  [UNO_R3;WO ARDUINO UNO]
U21  0.91 inch OLED module  [0.91 INCH OLED MODULE]
U22  0.91" 128x32 OLED Display Dawid  [0.91" 128X32 OLED DISPLAY DAWID]
U23  0.96 inch oled display  [0.96 INCH OLED DISPLAY]
sheet 16X2 LCD Display I2C
U27  Arduino Uno  [UNO_R3;WO ARDUINO UNO]
U28  ARDUINO_NANO  [COMM-TH_ARDUINO_NANO]
U29  I2C LCD 16X2  [LCD_16X2_I2C_V2]
sheet Arduino_EM-18 Module
2.3K  NO  [2.2K METAL FILM 1/4W RESISTOR]
2R  NO  [2.2K METAL FILM 1/4W RESISTOR]
BUZZER3  BUZZER  [BUZ-TH_BD12.0-P6.00-D0.9-RD]
C5  100UF/16V  [CAP-TH_BD6.3-P2.50-D0.5-FD]
C6  104  [NP CAP-8*3.5-5.08MM]
LED2  NO  [LED5]
P3  HEADER PAD 3 PIN  [CONNECTOR_PINHEADER_2.54MM:PINHEADER_1X3]
Q5  BC557  [TO-92-3_L4.9-W3.7-P1.27-R]
U52  ARDUINO UNO GD32  [UNO_R3;WO ARDUINO UNO]
U53  NO  [EM_18]
sheet Arduino_Keypad 3X3
CN3  PINHEADER-6PIN6  [PINHEADER-6PIN]
U38  NO  [MICROSWITCH]
U39  NO  [MICROSWITCH]
U40  NO  [MICROSWITCH]
U41  NO  [MICROSWITCH]
U42  NO  [MICROSWITCH]
U43  NO  [MICROSWITCH]
U44  NO  [MICROSWITCH]
U45  NO  [MICROSWITCH]
U46  NO  [MICROSWITCH]
U47  ARDUINO UNO GD32  [UNO_R3;WO ARDUINO UNO]
sheet Arduino_LCD 16x2
LCD1  GLCD_128X64  [GLCD_128X64_LC-569-D]
LCD2  GLCD_128X64  [GLCD_128X64_LC-569-D]
LCD3  LCD 16x2  [CLASE10LCD16X2]
LCD4  LCD1602  [LCD1602]
PCB1  ARDUINO UNO R3  [ARDUINO_ARDUINO_UNOR3]
PCB2  ARDUINO UNO R3  [ARDUINO_ARDUINO_UNOR3]
R1  10K Potentiometer With Knob 90  [10K-POTENTIOMETER]
R2  10K Potentiometer With Knob 90  [10K-POTENTIOMETER]
U24  ARDUINO_NANO  [COMM-TH_ARDUINO_NANO]
U26  10k Potentiometer  [10K POTENTIOMETER]
U48  1k potentiometer  [POTENTIOMETER BLUE]
U49  6-pin male-male header  [5-PIN MALE-MALE HEADER]
U50  2-PIN-MALE HEADER  [2PIN-MALE HEADER]
U51  ARDUINO UNO GD32  [UNO_R3;WO ARDUINO UNO]
sheet Arduino_Relay Module
D3  1N4007  [DO-41_BD2.4-L4.7-P8.70-D0.9-RD]
Q6  BC548B  [TO-92-3_L4.9-W3.7-P1.27-L]
R7  1000Ω  [330Ω RESISTANCE]
R8  1000Ω  [330Ω RESISTANCE]
R9  1000Ω  [330Ω RESISTANCE]
U54  ARDUINO UNO GD32  [UNO_R3;WO ARDUINO UNO]
U55  NO  [RELAY-TH_SRD-XXVDC-XL-C]
U56  LED  [LED5]
U57  LED  [LED5]
U58  3 PIN MALE JAMPER  [3PIN FEMALE HEADER]
U59  3PIN TERMINALBOCK  [5A_3PIN-TERMINALBLOCK]
sheet BH1750 
U11  BH1750  [BH1750]
U12  BH1750-PINOUT-NEW  [BH1750-PINOUT-F]
U13  BH1750  [BH1750_MODULE]
U14  BH1750  [BH1750]
U15  ARDUINO_NANO  [COMM-TH_ARDUINO_NANO]
U16  Arduino Uno  [UNO_R3;WO ARDUINO UNO]
sheet Capacitive Soil Moisture Sensor
U4  Capacitive Soil Moisture Sensor v1.2  [CAPACITIVE SOIL MOISTURE SENSOR V1.2 PCB]
U5  Capacitive Soil Moisture Sensor v1.2
U6  ARDUINO_NANO  [COMM-TH_ARDUINO_NANO]
U7  Arduino Uno  [UNO_R3;WO ARDUINO UNO]
U8  CAPACITIVE SOIL MOISTURE SENSOR 2  [CAPACITIVE SOIL MOISTURE SENSOR LAYOUT 2]
sheet DHT-11 & DHT-22
DD1  DHT-11  [DHT11F]
U1  Arduino Uno  [UNO_R3;WO ARDUINO UNO]
U2  ARDUINO_NANO  [COMM-TH_ARDUINO_NANO]
U3  DHT-11  [DHT-11]
sheet Relay copy
J2  RELAY  [RELAY MODULE 1 RELAYS]
NODE5  NODE_MCU_V3_ESP8266  [NODEMCU-12E;NODEMCU-ESP8266]
P1  HEADER PAD 3 PIN  [CONNECTOR_PINHEADER_2.54MM:PINHEADER_1X3]
P2  HEADER PAD 3 PIN  [CONNECTOR_PINHEADER_2.54MM:PINHEADER_1X3]
U17  ARDUINO_NANO  [COMM-TH_ARDUINO_NANO]
U18  Arduino Uno  [UNO_R3;WO ARDUINO UNO]
sheet Soil Moisture Sensor
H1  4Pin  [HEADERPIN4PIN]
S1  Soil Moisture Sensor  [SOIL MOISTURE SENSOR]
U9  ARDUINO_NANO  [COMM-TH_ARDUINO_NANO]
U10  Arduino Uno  [UNO_R3;WO ARDUINO UNO]

## Library data of the parts
U2 U6 U9 U15 U17 U19 U24 U28 = ARDUINO_NANO: Contributor: lcsc; Supplier: LCSC; Supplier Part: C9900017879; Manufacturer: null; JLCPCB Part Class: Extended Part
U1 U7 U10 U16 U18 U20 U27 = Arduino Uno: Contributor: Peter Story; sourceId: frlCUcuMG
U21 = 0.91 inch OLED module: Contributor: Мурат Еньков
U22 = 0.91" 128x32 OLED Display Dawid: Contributor: dawidbredenkamp
U23 = 0.96 inch oled display: Contributor: noorul_haque
U29 = I2C LCD 16X2: Contributor: vipe
2.3K 2R = 1/4W-2.2KΩ±1%: Manufacturer: Huaxing Mechanical-Elec.; Supplier: LCSC; Supplier Part: C714002; Contributor: jellybeanstaffy; Convert to PCB: Yes; Add into BOM: Yes
BUZZER3 = BUZZER: Contributor: lcsc; Supplier: LCSC; Supplier Part: C9900014030; Manufacturer: null; Manufacturer Part: buzzer; JLCPCB Part Class: Extended Part; link: https://lcsc.com/eda_search?q=C9900014030&%26type=1&ref=editor
C5 = 100UF/16V: Supplier: LCSC; Supplier Part: C9900021331; Manufacturer: null; Manufacturer Part: 100uF/16V; JLCPCB Part Class: Extended Part; Contributor: lcsc
C6 = 104nf: Supplier: LCSC; Manufacturer: ReliaPro; Manufacturer Part: Suppression Capacitor222M/250V; Supplier Part: C46751; Contributor: sunbin
LED2 U56 U57 = -LED
P1-P3 = HEADER PAD 3 PIN: Supplier: LCSC; Manufacturer: BOOMELE; Manufacturer Part: Female headerHDR1X8-2.54; Supplier Part: C27438; JLCPCB Part Class: Extended Part; Contributor: vincentboisselier
Q5 = BC557: Contributor: LCSC; Supplier Part: C180418; Supplier: LCSC; Manufacturer: CJ(江苏长电/长晶); JLCPCB Part Class: Extended Part; link: https://lcsc.com/eda_search?q=C180418&%26type=1&ref=editor
U47 U51 U52 U54 = ARDUINO UNO GD32: Contributor: obaida.bohsas.shark; sourceId: frlCUcuMG
U53 = EM-18: Contributor: muhammedimdaad16
CN3 = PINHEADER-6PIN6: Contributor: tiennguyenanh1
U38-U46 = ESO_SPST_Momentary: Contributor: LuckyStiff63; sourceId: F4cICwqI0
LCD1 LCD2 = GLCD_128X64: Contributor: arsyaahmad968
LCD3 = LCD 16x2: Contributor: yutthanasing
LCD4 = LCD1602: Manufacturer: LONTECH(厦门龙特); Manufacturer Part: LCM1602K-NSW-BBW; Supplier Part: C83275; Supplier: LCSC; Contributor: LCEDA_Lib
PCB1 PCB2 = ARDUINO UNO R3: Contributor: a20212416; Supplier: Botland
R1 R2 = 10K-POTENTIOMETER COPY: Contributor: whitehatgamer
U26 = 10k Potentiometer: Contributor: Sagar Karnewar
U48 = Pot_blue: Supplier Part: C61836; Contributor: Dennis van der Velde; Convert to PCB: Yes; Add into BOM: Yes
U49 = 6-pin male-male header: Manufacturer: TE Connectivity; Manufacturer Part: 87224-5; Supplier Part: A26549-ND; link: https://www.digikey.com/en/products/detail/te-connectivity-amp-connectors/87224-5/295324?utm_adgroup=Essen%20Deinki&utm_source=google&utm_medium=cpc&utm_campaign=Shopping_DK%2BSupplier_Other&utm_term=&utm_content=Essen%20Deinki&gclid=EAIaIQobChMIl76j1KPQ9wIVirfICh1BfwQCEAQYASABEgL9fPD_BwE; Contributor: Soumarya
U50 = 2-PIN-MALE HEADER: Manufacturer: TE Connectivity; Manufacturer Part: 87224-5; Supplier Part: A26549-ND; link: https://www.digikey.com/en/products/detail/te-connectivity-amp-connectors/87224-5/295324?utm_adgroup=Essen%20Deinki&utm_source=google&utm_medium=cpc&utm_campaign=Shopping_DK%2BSupplier_Other&utm_term=&utm_content=Essen%20Deinki&gclid=EAIaIQobChMIl76j1KPQ9wIVirfICh1BfwQCEAQYASABEgL9fPD_BwE; Contributor: Soumarya
D3 = 1N4007: Supplier: LCSC; Manufacturer: ST(先科); Supplier Part: C106903; JLCPCB Part Class: Extended Part; link: https://lcsc.com/eda_search?q=C106903&%26type=1&ref=editor
Q6 = BC548B: Supplier: LCSC; Manufacturer: CJ(江苏长电/长晶); Manufacturer Part: BC548; Supplier Part: C36611; JLCPCB Part Class: Extended Part; link: https://lcsc.com/eda_search?q=C36611&%26type=1&ref=editor
R7-R9 = 330Ω RESISTANCE: Supplier Part: C410657; Supplier: LCSC; Contributor: pritams07
U55 = SRD-05VDC-SL-C: Supplier: LCSC; Manufacturer: 松乐; Supplier Part: C35449; JLCPCB Part Class: Extended Part; Contributor: danishjr.hd
U58 = 3 PIN MALE JAMPER: Manufacturer Part: 1x3 pin header; Contributor: SHUBHASHISH; Supplier Part: NA; Manufacturer: NA; link: NA
U59 = 3PIN TERMINALBOCK: Contributor: abdullahsesli
U11 = BH1750: Contributor: jesuschoy
U12 = BH1750-PINOUT-NEW: Manufacturer Part: New SchematicLib; Contributor: sm94126; Supplier: Tinytronics
U13 = BH1750: Contributor: dwipanjan
U14 = BH1750: Supplier: RS-Online; Contributor: SRY TIS
U4 = Capacitive Soil Moisture Sensor v1.2: Contributor: Pablo Avila
U5 = Capacitive Soil Moisture Sensor v1.2: Contributor: Franiel
U8 = CAPACITIVE SOIL MOISTURE SENSOR 2: Contributor: phatcomp_it
DD1 = DHT-11: Contributor: perchik36
U3 = DHT-11: Contributor: UzainYasin
J2 = RELAY: Manufacturer Part: 1-Channel 5V Relay Module w/ Opto-isolator; Supplier Part: SKU: 223429; link: http://www.volumerate.com/product/1-channel-5v-relay-module-w-opto-isolator-red-blue-223429; Contributor: Jehangirkhan
NODE5 = NODE_MCU_V3_ESP8266: Contributor: Denis09; Supplier: TME
H1 = 4Pin: Supplier: Hestore; Supplier Part: ZL201; Contributor: hunkrekker
S1 = Soil Moisture Sensor: Contributor: r.teerapong5456

## Nets
GND: BUZZER3.1(-) C5.2 C6.1 DD1.4(GND) H1.3(GND) J2.14(GND) LCD2.1(K) LCD2.20(GND) LCD3.1(Vss) LCD3.5(RW) LCD3.16(K) LCD4.1(VSS) LCD4.5(R/W) LCD4.16(BLK) LED2.CATHODE NODE5.17(GND) P1.2(GND) P2.1(GND) P3.2 PCB2.GND.. Q6.3(E) R2.1 S1.2(GND) U1.26(GND1) U2.4(GND) U3.3(GND) U4.1(GND) U6.4(GND) U7.26(GND1) U8.1(GND) U9.4(GND) U10.26(GND1) U11.2 U12.1(GND) U13.2(GND) U14.1(GND) U15.29(GND) U16.26(GND1) U17.29(GND) U18.26(GND1) U19.29(GND) U20.26(GND1) U21.1(GND) U22.4(GND) U23.GND(1) U24.29(GND) U26.3 U27.26(GND1) U28.4(GND) U29.1(GND) U48.1 U50.GND(2) U51.26(GND1) U52.26(GND1) U53.3(GND) U54.26(GND1) U57.CATHODE U58.2
VCC: C5.1 C6.2 D3.1(K) DD1.1(VDD) H1.4(VCC) J2.13(Vcc) LCD2.2(A) LCD2.19(VCC) LCD3.2(Vdd) LCD3.15(A) LCD4.2(VCC) LCD4.15(BLA) NODE5.16(3V3) P1.1(VCC) P2.2(VCC) P3.1 PCB2.5V Q5.3(E) R7.2 R8.2 S1.1(VCC) U1.28(5V) U2.27(+5V) U3.1(VCC) U4.2(VCC) U6.27(+5V) U7.28(5V) U8.2(VCC) U9.27(+5V) U10.28(5V) U11.1 U12.5(VCC) U13.1(VCC) U14.5(VCC) U15.27(+5V) U16.28(5V) U17.27(+5V) U18.28(5V) U19.27(+5V) U20.28(5V) U21.2(VCC) U22.3(VCC) U23.VCC(2) U24.27(+5V) U26.2 U27.28(5V) U28.27(+5V) U29.2(Vcc) U48.3(2) U50.VCC(1) U51.28(5V) U52.28(5V) U53.1(VCC) U53.7(SEL) U54.28(5V) U55.2(IN) U58.1
3: LCD2.3(VEE/NC) R2.2
18: LCD2.18(VO) R2.3
A0: H1.1(A0) LCD2.15(E) PCB2.A0 S1.4(A0) U9.19(A0) U10.24(14/A0/PC0)
A1: LCD2.16(R/W) PCB2.A1
A2: LCD2.5(NC) PCB2.A2
A3: LCD2.4(RST) PCB2.A3
A4: LCD2.6(PSB) PCB2.A4
AD0: U12.2(AD0) U14.2(ADO)
ADDR: U11.5 U13.5(ADD*) U15.22(A3) U16.21(17/A3/PC3)
AOUT: U4.3(AOUT) U6.19(A0) U7.24(14/A0/PC0) U8.3(AUOT)
C1: CN3.4(C1) U38.1 U38.2 U43.1 U43.2 U46.1 U46.2 U47.9(D8)
C2: CN3.5(C2) U39.1 U39.2 U42.1 U42.2 U45.1 U45.2 U47.10(D9)
C3: CN3.6(C3) U40.1 U40.2 U41.1 U41.2 U44.1 U44.2 U47.11(D10)
COM: U54.25(VIN) U55.3(COM) U59.2
D0: H1.2(D0) S1.3(D0) U9.11(D8) U10.9(PB0/8)
D4: LCD2.11(DB3) LCD3.11(DB4) LCD4.11(DB4) PCB2.4 U24.21(A2) U49.D4(4) U51.21(A3)
D5: LCD2.12(DB2) LCD3.12(DB5) LCD4.12(DB5) PCB2.5 U24.22(A3) U49.D5(3) U51.22(A2)
D6: LCD2.13(DB1) LCD3.13(DB6) LCD4.13(DB6) PCB2.6 U24.23(A4) U49.D6(2) U51.23(A1)
D7: LCD2.14(DB0) LCD3.14(DB7) LCD4.14(DB7) PCB2.7 U24.24(A5) U49.D7(1) U51.24(A0)
D8: LCD2.7(DB7) PCB2.8
D9: LCD2.8(DB6) PCB2.9
D10: LCD2.9(DB5) PCB2.10
D11: LCD2.10(DB4) PCB2.11
DATA: DD1.2(DATA) U1.7(PWR/PD6/6) U2.6(D3) U3.2(DATA)
E: LCD3.6(E) LCD4.6(E) U24.20(A1) U49.E(5) U51.20(A4)
IN: R9.2 U54.3(D2) U58.3
NC: U55.4(NC) U59.1
NO: U59.3
OUT: P3.3 U52.1(D0) U53.8(TX)
R1: CN3.1(R1) U38.3 U38.4 U39.3 U39.4 U40.3 U40.4 U47.6(D5)
R2: CN3.2(R2) U41.3 U41.4 U42.3 U42.4 U43.3 U43.4 U47.7(D6)
R3: CN3.3(R3) U44.3 U44.4 U45.3 U45.4 U46.3 U46.4 U47.8(D7)
RS: LCD3.4(RS) LCD4.4(RS) U24.19(A0) U49.RS(6) U51.19(A5)
RST: LCD2.17(RS) PCB2.RESET
SCL: U11.3 U12.4(SCL) U13.3(SCL) U14.4(SCL) U15.24(A5) U16.19(19/A5/PC5/SCL) U19.24(A5) U20.19(19/A5/PC5/SCL) U21.3(SCL) U22.2(SCL) U23.SCL(3) U27.19(19/A5/PC5/SCL) U28.24(A5) U29.3(SCL)
SDA: U11.4 U12.3(SDA) U13.4(SDA) U14.3(SDA) U15.23(A4) U16.20(18/A4/PC4/SDA) U19.23(A4) U20.20(18/A4/PC4/SDA) U21.4(SDA) U22.1(SDA) U23.SDA(4) U27.20(18/A4/PC4/SDA) U28.23(A4) U29.4(SDA)
SIG: J2.15(SIG) NODE5.20(D8) P1.3(SIG) P2.3(SIG) U17.11(D8) U18.9(PB0/8)
Net-(2.3K-1): 2.3K.1 U53.4(LED)
Net-(2.3K-2): 2.3K.2 Q5.2(B)
Net-(2R-1): 2R.1 BUZZER3.2(+) Q5.1(C)
Net-(2R-2): 2R.2 LED2.ANODE
Net-(D3-2): D3.2(A) Q6.1(C) U55.1(OT) U56.CATHODE
Net-(LCD1-1): LCD1.1(K) LCD1.20(GND) PCB1.GND R1.1
Net-(LCD1-2): LCD1.2(A) LCD1.19(VCC) PCB1.5V
Net-(LCD1-3): LCD1.3(VEE/NC) R1.2
Net-(LCD1-4): LCD1.4(RST) PCB1.A3
Net-(LCD1-5): LCD1.5(CS2) PCB1.A2
Net-(LCD1-6): LCD1.6(CS1) PCB1.A4
Net-(LCD1-7): LCD1.7(DB7) PCB1.8
Net-(LCD1-8): LCD1.8(DB6) PCB1.9
Net-(LCD1-9): LCD1.9(DB5) PCB1.10
Net-(LCD1-10): LCD1.10(DB4) PCB1.11
Net-(LCD1-11): LCD1.11(DB3) PCB1.4
Net-(LCD1-12): LCD1.12(DB2) PCB1.5
Net-(LCD1-13): LCD1.13(DB1) PCB1.6
Net-(LCD1-14): LCD1.14(DB0) PCB1.7
Net-(LCD1-15): LCD1.15(E) PCB1.A0
Net-(LCD1-16): LCD1.16(R/W) PCB1.A1
Net-(LCD1-17): LCD1.17(RS) PCB1.RESET
Net-(LCD1-18): LCD1.18(VO) R1.3
Net-(LCD3-3): LCD3.3(V0) U48.2(3)
Net-(LCD4-3): LCD4.3(VO) U26.1
Net-(Q6-2): Q6.2(B) R9.1
Net-(R7-1): R7.1 U56.ANODE
Net-(R8-1): R8.1 U57.ANODE

Not connected (* = marked no-connect by the designer): DD1 3(NC); J2 1(NO) 2(COM) 3(NC); LCD3 7(DB0) 8(DB1) 9(DB2) 10(DB3); LCD4 7(DB0) 8(DB1) 9(DB2) 10(DB3); NODE5 1(A0) 2(GND) 3(VU) 4(S3) 5(S2) 6(S1) 7(SC) 8(SO) 9(SK) 10(GND) 11(3V3) 12(EN) 13(RST) 14(GND) 15(Vin) 18(TX) 19(RX) 21(D7) 22(D6) 23(D5) 24(GND) 25(3V3) 26(D4) 27(D3) 28(D2) 29(D1) 30(D0); PCB1 0(0(RX)) 1(1(TX)) 2 3 3.3V 12 13 A5 AREF GND. GND.. I/OREF(IOREF) N/C((N/C)) PWR+(DC JACK +) PWR-(DC JACK -) SCL(28(SCL)) SDA(27(SDA)) VIN; PCB2 0(0(RX)) 1(1(TX)) 2 3 3.3V 12 13 A5 AREF GND GND. I/OREF(IOREF) N/C((N/C)) PWR+(DC JACK +) PWR-(DC JACK -) SCL(28(SCL)) SDA(27(SDA)) VIN; S1 5(S+) 6(S-); U1 1(RX/PD0/0) 2(TX/PD1/1) 3(INT0/PD2/2) 4(INT1/PWR/PD3/3) 5(PD4/4) 6(PWR/PD5/5) 8(PD7/7) 9(PB0/8) 10(PWR/PB1/9) 11(SS/PWR/PB2/10) 12(MOSI/PWR/PB3/11) 13(MISO/PB4/12) 14(SCK/PB5/13) 15(GND) 16(AREF) 17(SDA) 18(SCL) 19(19/A5/PC5/SCL) 20(18/A4/PC4/SDA) 21(17/A3/PC3) 22(16/A2/PC2) 23(15/A1/PC1) 24(14/A0/PC0) 25(VIN) 27(GND2) 29(3V) 30(RESET) 31(IOREF) 32(NC); U2 1(D1/TX) 2(D0/RX) 3(RESET) 5(D2) 7(D4) 8(D5) 9(D6) 10(D7) 11(D8) 12(D9) 13(D10) 14(D11) 15(D12) 16(D13) 17(3V3) 18(AREF) 19(A0) 20(A1) 21(A2) 22(A3) 23(A4) 24(A5) 25(A6) 26(A7) 28(RESET) 29(GND) 30(VIN); U5 1(GND) 2(VCC) 3(AOUT); U6 1(D1/TX) 2(D0/RX) 3(RESET) 5(D2) 6(D3) 7(D4) 8(D5) 9(D6) 10(D7) 11(D8) 12(D9) 13(D10) 14(D11) 15(D12) 16(D13) 17(3V3) 18(AREF) 20(A1) 21(A2) 22(A3) 23(A4) 24(A5) 25(A6) 26(A7) 28(RESET) 29(GND) 30(VIN); U7 1(RX/PD0/0) 2(TX/PD1/1) 3(INT0/PD2/2) 4(INT1/PWR/PD3/3) 5(PD4/4) 6(PWR/PD5/5) 7(PWR/PD6/6) 8(PD7/7) 9(PB0/8) 10(PWR/PB1/9) 11(SS/PWR/PB2/10) 12(MOSI/PWR/PB3/11) 13(MISO/PB4/12) 14(SCK/PB5/13) 15(GND) 16(AREF) 17(SDA) 18(SCL) 19(19/A5/PC5/SCL) 20(18/A4/PC4/SDA) 21(17/A3/PC3) 22(16/A2/PC2) 23(15/A1/PC1) 25(VIN) 27(GND2) 29(3V) 30(RESET) 31(IOREF) 32(NC); U9 1(D1/TX) 2(D0/RX) 3(RESET) 5(D2) 6(D3) 7(D4) 8(D5) 9(D6) 10(D7) 12(D9) 13(D10) 14(D11) 15(D12) 16(D13) 17(3V3) 18(AREF) 20(A1) 21(A2) 22(A3) 23(A4) 24(A5) 25(A6) 26(A7) 28(RESET) 29(GND) 30(VIN); U10 1(RX/PD0/0) 2(TX/PD1/1) 3(INT0/PD2/2) 4(INT1/PWR/PD3/3) 5(PD4/4) 6(PWR/PD5/5) 7(PWR/PD6/6) 8(PD7/7) 10(PWR/PB1/9) 11(SS/PWR/PB2/10) 12(MOSI/PWR/PB3/11) 13(MISO/PB4/12) 14(SCK/PB5/13) 15(GND) 16(AREF) 17(SDA) 18(SCL) 19(19/A5/PC5/SCL) 20(18/A4/PC4/SDA) 21(17/A3/PC3) 22(16/A2/PC2) 23(15/A1/PC1) 25(VIN) 27(GND2) 29(3V) 30(RESET) 31(IOREF) 32(NC); U15 1(D1/TX) 2(D0/RX) 3(RESET) 4(GND) 5(D2) 6(D3) 7(D4) 8(D5) 9(D6) 10(D7) 11(D8) 12(D9) 13(D10) 14(D11) 15(D12) 16(D13) 17(3V3) 18(AREF) 19(A0) 20(A1) 21(A2) 25(A6) 26(A7) 28(RESET) 30(VIN); U16 1(RX/PD0/0) 2(TX/PD1/1) 3(INT0/PD2/2) 4(INT1/PWR/PD3/3) 5(PD4/4) 6(PWR/PD5/5) 7(PWR/PD6/6) 8(PD7/7) 9(PB0/8) 10(PWR/PB1/9) 11(SS/PWR/PB2/10) 12(MOSI/PWR/PB3/11) 13(MISO/PB4/12) 14(SCK/PB5/13) 15(GND) 16(AREF) 17(SDA) 18(SCL) 22(16/A2/PC2) 23(15/A1/PC1) 24(14/A0/PC0) 25(VIN) 27(GND2) 29(3V) 30(RESET) 31(IOREF) 32(NC); U17 1(D1/TX) 2(D0/RX) 3(RESET) 4(GND) 5(D2) 6(D3) 7(D4) 8(D5) 9(D6) 10(D7) 12(D9) 13(D10) 14(D11) 15(D12) 16(D13) 17(3V3) 18(AREF) 19(A0) 20(A1) 21(A2) 22(A3) 23(A4) 24(A5) 25(A6) 26(A7) 28(RESET) 30(VIN); U18 1(RX/PD0/0) 2(TX/PD1/1) 3(INT0/PD2/2) 4(INT1/PWR/PD3/3) 5(PD4/4) 6(PWR/PD5/5) 7(PWR/PD6/6) 8(PD7/7) 10(PWR/PB1/9) 11(SS/PWR/PB2/10) 12(MOSI/PWR/PB3/11) 13(MISO/PB4/12) 14(SCK/PB5/13) 15(GND) 16(AREF) 17(SDA) 18(SCL) 19(19/A5/PC5/SCL) 20(18/A4/PC4/SDA) 21(17/A3/PC3) 22(16/A2/PC2) 23(15/A1/PC1) 24(14/A0/PC0) 25(VIN) 27(GND2) 29(3V) 30(RESET) 31(IOREF) 32(NC); U19 1(D1/TX) 2(D0/RX) 3(RESET) 4(GND) 5(D2) 6(D3) 7(D4) 8(D5) 9(D6) 10(D7) 11(D8) 12(D9) 13(D10) 14(D11) 15(D12) 16(D13) 17(3V3) 18(AREF) 19(A0) 20(A1) 21(A2) 22(A3) 25(A6) 26(A7) 28(RESET) 30(VIN); U20 1(RX/PD0/0) 2(TX/PD1/1) 3(INT0/PD2/2) 4(INT1/PWR/PD3/3) 5(PD4/4) 6(PWR/PD5/5) 7(PWR/PD6/6) 8(PD7/7) 9(PB0/8) 10(PWR/PB1/9) 11(SS/PWR/PB2/10) 12(MOSI/PWR/PB3/11) 13(MISO/PB4/12) 14(SCK/PB5/13) 15(GND) 16(AREF) 17(SDA) 18(SCL) 21(17/A3/PC3) 22(16/A2/PC2) 23(15/A1/PC1) 24(14/A0/PC0) 25(VIN) 27(GND2) 29(3V) 30(RESET) 31(IOREF) 32(NC); U24 1(D1/TX) 2(D0/RX) 3(RESET) 4(GND) 5(D2) 6(D3) 7(D4) 8(D5) 9(D6) 10(D7) 11(D8) 12(D9) 13(D10) 14(D11) 15(D12) 16(D13) 17(3V3) 18(AREF) 25(A6) 26(A7) 28(RESET) 30(VIN); U27 1(RX/PD0/0) 2(TX/PD1/1) 3(INT0/PD2/2) 4(INT1/PWR/PD3/3) 5(PD4/4) 6(PWR/PD5/5) 7(PWR/PD6/6) 8(PD7/7) 9(PB0/8) 10(PWR/PB1/9) 11(SS/PWR/PB2/10) 12(MOSI/PWR/PB3/11) 13(MISO/PB4/12) 14(SCK/PB5/13) 15(GND) 16(AREF) 17(SDA) 18(SCL) 21(17/A3/PC3) 22(16/A2/PC2) 23(15/A1/PC1) 24(14/A0/PC0) 25(VIN) 27(GND2) 29(3V) 30(RESET) 31(IOREF) 32(NC); U28 1(D1/TX) 2(D0/RX) 3(RESET) 5(D2) 6(D3) 7(D4) 8(D5) 9(D6) 10(D7) 11(D8) 12(D9) 13(D10) 14(D11) 15(D12) 16(D13) 17(3V3) 18(AREF) 19(A0) 20(A1) 21(A2) 22(A3) 25(A6) 26(A7) 28(RESET) 29(GND) 30(VIN); U47 1(D0) 2(D1) 3(D2) 4(D3) 5(D4) 12(D11) 13(D12) 14(D13) 15(GND) 16(AREF) 17(SDA) 18(SCL) 19(A5) 20(A4) 21(A3) 22(A2) 23(A1) 24(A0) 25(VIN) 26(GND1) 27(GND2) 28(5V) 29(3V) 30(RESET) 31(IOREF) 32(USART1); U51 1(D0) 2(D1) 3(D2) 4(D3) 5(D4) 6(D5) 7(D6) 8(D7) 9(D8) 10(D9) 11(D10) 12(D11) 13(D12) 14(D13) 15(GND) 16(AREF) 17(SDA) 18(SCL) 25(VIN) 27(GND2) 29(3V) 30(RESET) 31(IOREF) 32(USART1); U52 2(D1) 3(D2) 4(D3) 5(D4) 6(D5) 7(D6) 8(D7) 9(D8) 10(D9) 11(D10) 12(D11) 13(D12) 14(D13) 15(GND) 16(AREF) 17(SDA) 18(SCL) 19(A5) 20(A4) 21(A3) 22(A2) 23(A1) 24(A0) 25(VIN) 27(GND2) 29(3V) 30(RESET) 31(IOREF) 32(USART1); U53 2(NC) 5(NC) 6(NC) 9(D1) 10(D2); U54 1(D0) 2(D1) 4(D3) 5(D4) 6(D5) 7(D6) 8(D7) 9(D8) 10(D9) 11(D10) 12(D11) 13(D12) 14(D13) 15(GND) 16(AREF) 17(SDA) 18(SCL) 19(A5) 20(A4) 21(A3) 22(A2) 23(A1) 24(A0) 27(GND2) 29(3V) 30(RESET) 31(IOREF) 32(USART1); U55 5(NO)

## Notes on the sheets
sheet 4
- 5V RELAY
